# EAGLE design KramerMC_CPU_ferryTALE2022_v1.0 (EAGLE 6.6.0)

## Sheet 1 of 3: CPU+MEM
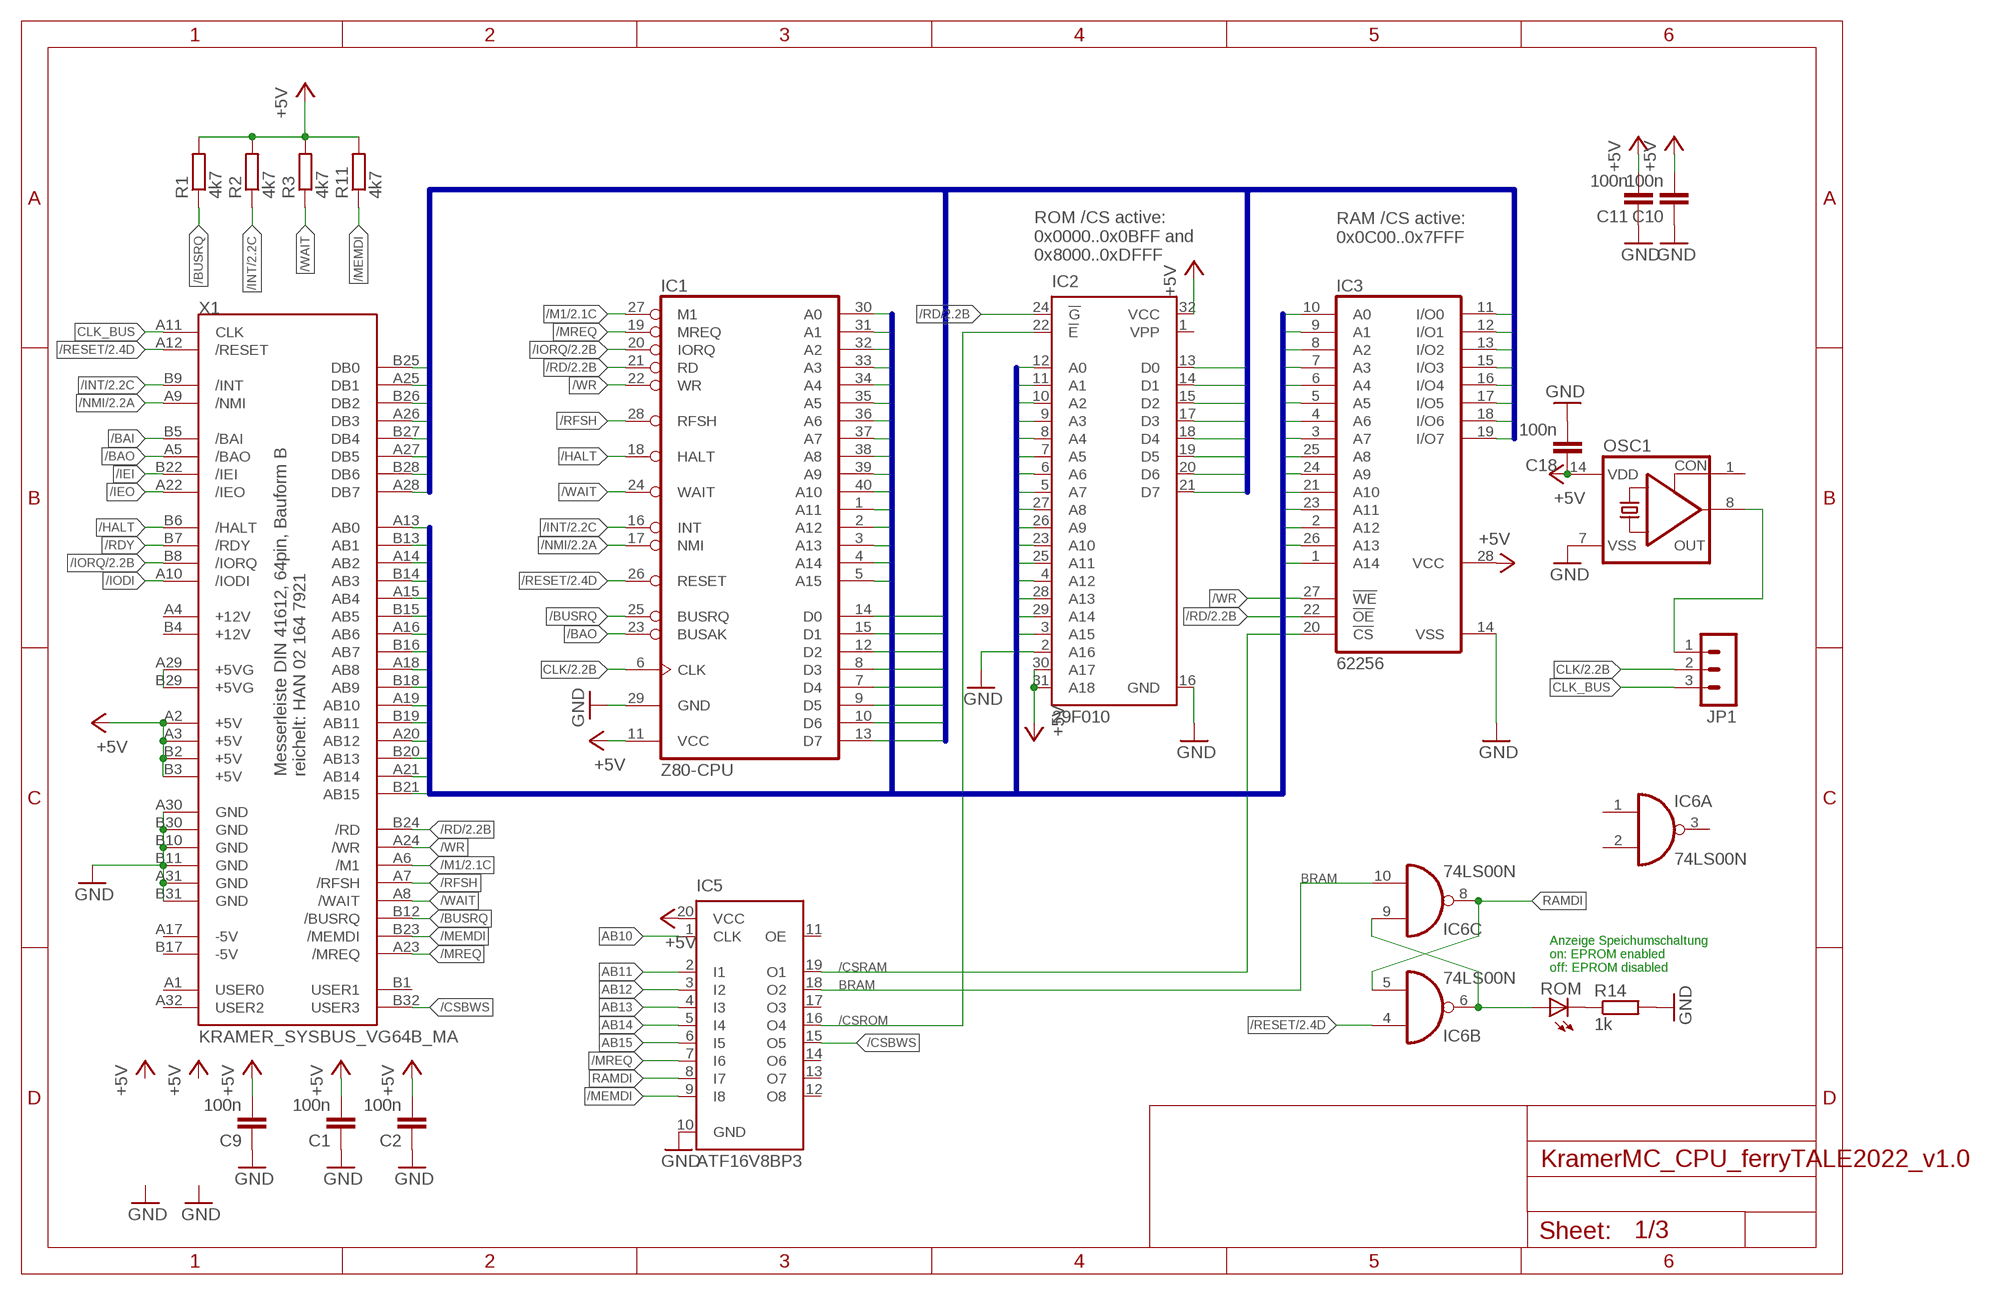
[diagram p0: schematic, sheet 1]

### Parts
C1  100n  C-EU050-024X044  [C050-024X044]
C2  100n  C-EU050-024X044  [C050-024X044]
C9  100n  C-EU050-024X044  [C050-024X044]
C10  100n  C-EU050-024X044  [C050-024X044]
C11  100n  C-EU050-024X044  [C050-024X044]
C18  100n  C-EU050-024X044  [C050-024X044]
IC1  Z80-CPU  Z80CPU  [DIL40]
IC2  29F010  M27C4001B  [DIL32]
IC3  62256  62256P  [DIL28-6]
IC5  ATF16V8BP3  [DIL20]
IC6  74LS00N  [DIL14]
JP1  MA03-1  [MA03-1]
OSC1  CRYSTAL_RES-SG51  [SG51]
R1  4k7  R-EU_0207/10  [0207/10]
R2  4k7  R-EU_0207/10  [0207/10]
R3  4k7  R-EU_0207/10  [0207/10]
R11  4k7  R-EU_0207/10  [0207/10]
R14  1k  R-EU_0207/10  [0207/10]
ROM  LED3MM  [LED3MM]
X1  KRAMER_SYSBUS_VG64B_MA  [MAB64]

### Nets
+5V: C1.2 C2.2 C9.2 C10.2 C11.2 C18.1 IC1.11(VCC) IC2.30(A17) IC2.31(A18) IC2.32(VCC) IC3.28(VCC) IC5.20(VCC) OSC1.14(VDD) R1.2 R2.2 R3.2 R11.2 X1.A2(+5V) X1.A3(+5V) X1.B2(+5V) X1.B3(+5V) ; also sheet 2,3
+5VG: X1.A29(+5VG) X1.B29(+5VG)
/BAI: X1.B5(/BAI)
/BAO: IC1.23(BUSAK) X1.A5(/BAO)
/BUSRQ: IC1.25(BUSRQ) R1.1 X1.B12(/BUSRQ)
/CSBWS: IC5.15(O5) X1.B32(USER3)
/CSRAM: IC3.20(!CS) IC5.19(O1)
/CSROM: IC2.22(!E) IC5.16(O4)
/HALT: IC1.18(HALT) X1.B6(/HALT)
/IEI: X1.B22(/IEI)
/IEO: X1.A22(/IEO)
/INT: IC1.16(INT) R2.1 X1.B9(/INT) ; also sheet 2
/IODI: X1.A10(/IODI)
/IORQ: IC1.20(IORQ) X1.B8(/IORQ) ; also sheet 2
/M1: IC1.27(M1) X1.A6(/M1) ; also sheet 2
/MEMDI: IC5.9(I8) R11.1 X1.B23(/MEMDI)
/MREQ: IC1.19(MREQ) IC5.7(I6) X1.A23(/MREQ)
/NMI: IC1.17(NMI) X1.A9(/NMI) ; also sheet 2
/RD: IC1.21(RD) IC2.24(!G) IC3.22(!OE) X1.B24(/RD) ; also sheet 2
/RDY: X1.B7(/RDY)
/RESET: IC1.26(RESET) IC6.4(B:I0) X1.A12(/RESET) ; also sheet 2
/RFSH: IC1.28(RFSH) X1.A7(/RFSH)
/WAIT: IC1.24(WAIT) R3.1 X1.A8(/WAIT)
/WR: IC1.22(WR) IC3.27(!WE) X1.A24(/WR)
AB0: IC1.30(A0) IC2.12(A0) IC3.10(A0) X1.A13(AB0) ; also sheet 2
AB1: IC1.31(A1) IC2.11(A1) IC3.9(A1) X1.B13(AB1) ; also sheet 2
AB2: IC1.32(A2) IC2.10(A2) IC3.8(A2) X1.A14(AB2)
AB3: IC1.33(A3) IC2.9(A3) IC3.7(A3) X1.B14(AB3)
AB4: IC1.34(A4) IC2.8(A4) IC3.6(A4) X1.A15(AB4)
AB5: IC1.35(A5) IC2.7(A5) IC3.5(A5) X1.B15(AB5)
AB6: IC1.36(A6) IC2.6(A6) IC3.4(A6) X1.A16(AB6) ; also sheet 2
AB7: IC1.37(A7) IC2.5(A7) IC3.3(A7) X1.B16(AB7) ; also sheet 2
AB8: IC1.38(A8) IC2.27(A8) IC3.25(A8) X1.A18(AB8)
AB9: IC1.39(A9) IC2.26(A9) IC3.24(A9) X1.B18(AB9)
AB10: IC1.40(A10) IC2.23(A10) IC3.21(A10) IC5.1(CLK) X1.A19(AB10)
AB11: IC1.1(A11) IC2.25(A11) IC3.23(A11) IC5.2(I1) X1.B19(AB11)
AB12: IC1.2(A12) IC2.4(A12) IC3.2(A12) IC5.3(I2) X1.A20(AB12)
AB13: IC1.3(A13) IC2.28(A13) IC3.26(A13) IC5.4(I3) X1.B20(AB13)
AB14: IC1.4(A14) IC2.29(A14) IC3.1(A14) IC5.5(I4) X1.A21(AB14)
AB15: IC1.5(A15) IC2.3(A15) IC5.6(I5) X1.B21(AB15)
BRAM: IC5.18(O2) IC6.10(C:I1)
CLK: IC1.6(CLK) JP1.2 ; also sheet 2
CLK_BUS: JP1.3 X1.A11(CLK)
DB0: IC1.14(D0) IC2.13(D0) IC3.11(I/O0) X1.B25(DB0) ; also sheet 2
DB1: IC1.15(D1) IC2.14(D1) IC3.12(I/O1) X1.A25(DB1) ; also sheet 2
DB2: IC1.12(D2) IC2.15(D2) IC3.13(I/O2) X1.B26(DB2) ; also sheet 2
DB3: IC1.8(D3) IC2.17(D3) IC3.15(I/O3) X1.A26(DB3) ; also sheet 2
DB4: IC1.7(D4) IC2.18(D4) IC3.16(I/O4) X1.B27(DB4) ; also sheet 2
DB5: IC1.9(D5) IC2.19(D5) IC3.17(I/O5) X1.A27(DB5) ; also sheet 2
DB6: IC1.10(D6) IC2.20(D6) IC3.18(I/O6) X1.B28(DB6) ; also sheet 2
DB7: IC1.13(D7) IC2.21(D7) IC3.19(I/O7) X1.A28(DB7) ; also sheet 2
GND: C1.1 C2.1 C9.1 C10.1 C11.1 C18.2 IC1.29(GND) IC2.2(A16) IC2.16(GND) IC3.14(VSS) IC5.10(GND) OSC1.7(VSS) R14.2 X1.A30(GND) X1.A31(GND) X1.B10(GND) X1.B11(GND) X1.B30(GND) X1.B31(GND) ; also sheet 2,3
N$1: IC6.6(B:O) IC6.9(C:I0) ROM.A
N$5: R14.1 ROM.K(C)
N$48: JP1.1 OSC1.8(OUT)
RAMDI: IC5.8(I7) IC6.5(B:I1) IC6.8(C:O)
Unconnected: IC5.11(OE) IC5.12(O8) IC5.13(O7) IC5.14(O6) IC5.17(O3) IC6.1(A:I0) IC6.2(A:I1) IC6.3(A:O) OSC1.1(CON) X1.A1(USER0) X1.A4(+12V) X1.A17(-5V) X1.A32(USER2) X1.B1(USER1) X1.B4(+12V) X1.B17(-5V)

### Buses
DB
AB

### Notes on the sheet
- RAM /CS active:
  0x0C00..0x7FFF
- ROM /CS active:
  0x0000..0x0BFF and
  0x8000..0xDFFF
- Messerleiste DIN 41612, 64pin, Bauform B
  reichelt: HAN 02 164 7921
- Anzeige Speichumschaltung
  on: EPROM enabled
  off: EPROM disabled

## Sheet 2 of 3: Keyb
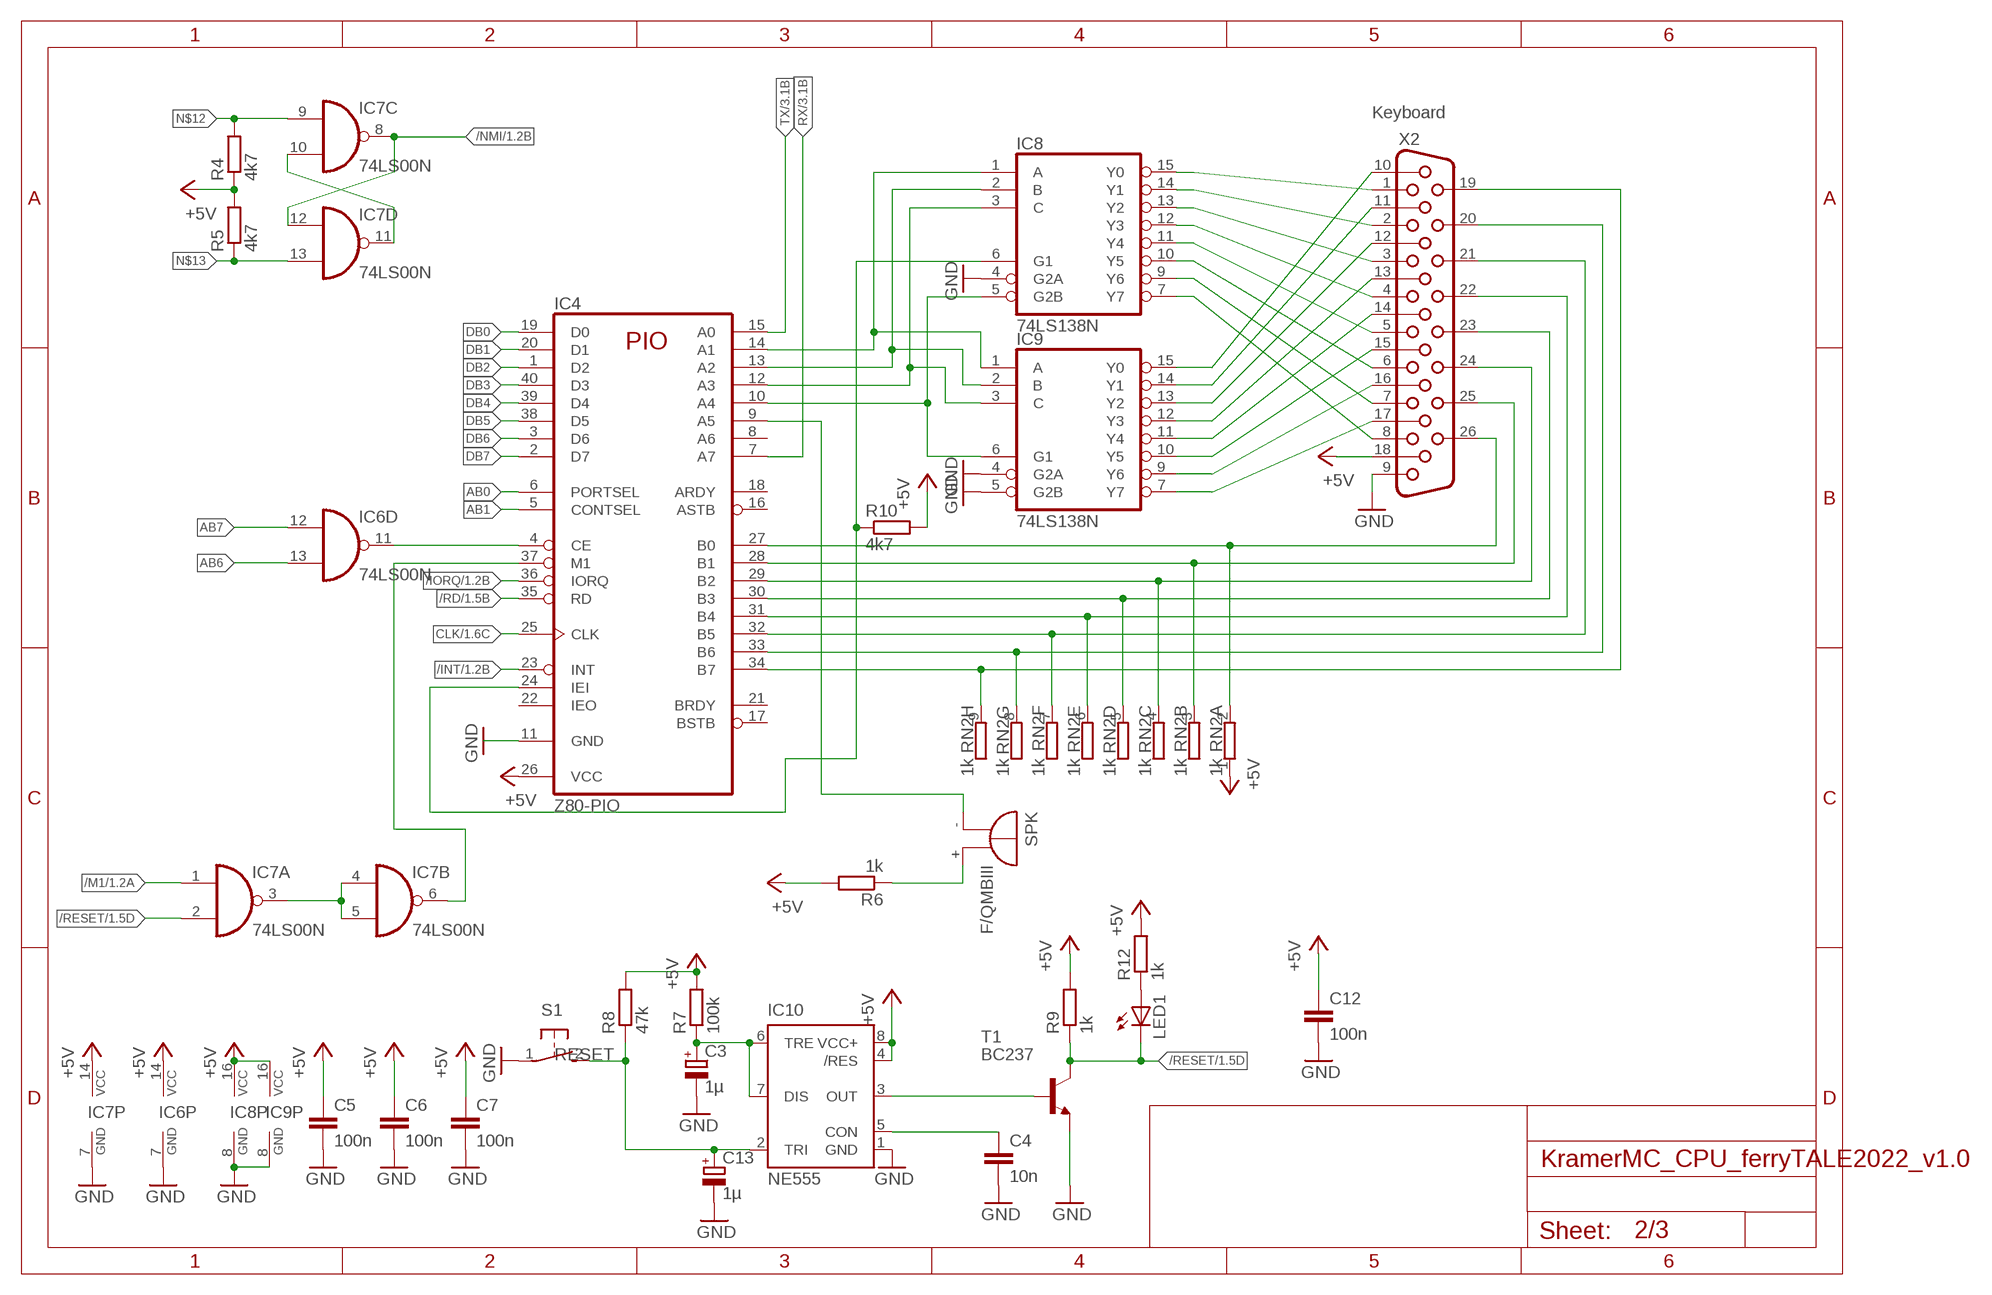
[diagram p1: schematic, sheet 2]

### Parts
C3  1µ  CPOL-EUE2-5  [E2-5]
C4  10n  C-EU050-024X044  [C050-024X044]
C5  100n  C-EU050-024X044  [C050-024X044]
C6  100n  C-EU050-024X044  [C050-024X044]
C7  100n  C-EU050-024X044  [C050-024X044]
C12  100n  C-EU050-024X044  [C050-024X044]
C13  1µ  CPOL-EUE2-5  [E2-5]
IC4  Z80-PIO  Z80PIO  [DIL40]
IC7  74LS00N  [DIL14]
IC8  74LS138N  [DIL16]
IC9  74LS138N  [DIL16]
IC10  NE555  [DIL-08]
LED1  LED3MM  [LED3MM]
R4  4k7  R-EU_0207/10  [0207/10]
R5  4k7  R-EU_0207/10  [0207/10]
R6  1k  R-EU_0207/10  [0207/10]
R7  100k  R-EU_0207/2V  [0207/2V]
R8  47k  R-EU_0207/10  [0207/10]
R9  1k  R-EU_0207/2V  [0207/2V]
R10  4k7  R-EU_0207/10  [0207/10]
R12  1k  R-EU_0207/2V  [0207/2V]
RN2  1k  GE08R  [SIL9]
S1  31-XX  [B3F-31XX]
SPK  F/QMBIII  [F/QMBIII]
T1  BC237  [TO92]
X2  HF26H  [HDF26H]

### Nets
+5V: C5.1 C6.1 C7.1 C12.1 IC4.26(VCC) IC6.14(P:VCC) IC7.14(P:VCC) IC8.16(VCC) IC9.16(VCC) IC10.4(/RES) IC10.8(VCC+) R4.1 R5.2 R6.2 R7.2 R8.2 R9.2 R10.2 R12.2 RN2.1 X2.18 ; also sheet 1,3
/INT: IC4.23(INT) ; also sheet 1
/IORQ: IC4.36(IORQ) ; also sheet 1
/M1: IC7.1(A:I0) ; also sheet 1
/NMI: IC7.8(C:O) IC7.12(D:I0) ; also sheet 1
/RD: IC4.35(RD) ; also sheet 1
/RESET: IC7.2(A:I1) LED1.K(C) R9.1 T1.3(C) ; also sheet 1
AB0: IC4.6(PORTSEL) ; also sheet 1
AB1: IC4.5(CONTSEL) ; also sheet 1
AB6: IC6.13(D:I1) ; also sheet 1
AB7: IC6.12(D:I0) ; also sheet 1
CLK: IC4.25(CLK) ; also sheet 1
DB0: IC4.19(D0) ; also sheet 1
DB1: IC4.20(D1) ; also sheet 1
DB2: IC4.1(D2) ; also sheet 1
DB3: IC4.40(D3) ; also sheet 1
DB4: IC4.39(D4) ; also sheet 1
DB5: IC4.38(D5) ; also sheet 1
DB6: IC4.3(D6) ; also sheet 1
DB7: IC4.2(D7) ; also sheet 1
GND: C3.- C4.2 C5.2 C6.2 C7.2 C12.2 C13.- IC4.11(GND) IC6.7(P:GND) IC7.7(P:GND) IC8.4(G2A) IC8.8(GND) IC9.4(G2A) IC9.5(G2B) IC9.8(GND) IC10.1(GND) S1.1(P) T1.1(E) X2.9 ; also sheet 1,3
N$9: LED1.A R12.1
N$10: IC8.15(Y0) X2.1
N$11: IC7.10(C:I1) IC7.11(D:O)
N$12: IC7.9(C:I0) R4.2
N$13: IC7.13(D:I1) R5.1
N$14: IC4.14(A1) IC8.1(A) IC9.1(A)
N$15: IC4.13(A2) IC8.2(B) IC9.2(B)
N$16: IC4.12(A3) IC8.3(C) IC9.3(C)
N$17: IC7.3(A:O) IC7.4(B:I0) IC7.5(B:I1)
N$18: IC8.14(Y1) X2.2
N$19: IC4.4(CE) IC6.11(D:O)
N$20: IC4.37(M1) IC7.6(B:O)
N$21: IC8.13(Y2) X2.3
N$22: IC8.12(Y3) X2.4
N$23: IC8.11(Y4) X2.5
N$24: IC8.10(Y5) X2.6
N$25: IC8.9(Y6) X2.7
N$26: IC8.7(Y7) X2.8
N$27: IC4.27(B0) RN2.2 X2.26
N$28: IC4.28(B1) RN2.3 X2.25
N$29: IC4.29(B2) RN2.4 X2.24
N$30: IC4.30(B3) RN2.5 X2.23
N$31: IC4.31(B4) RN2.6 X2.22
N$32: IC4.32(B5) RN2.7 X2.21
N$33: IC4.33(B6) RN2.8 X2.20
N$34: IC4.34(B7) RN2.9 X2.19
N$35: IC4.9(A5) SPK.-(+)
N$36: IC10.3(OUT) T1.2(B)
N$37: C3.+ IC10.6(TRE) IC10.7(DIS) R7.1
N$38: C4.1 IC10.5(CON)
N$39: R6.1 SPK.+(-)
N$40: IC4.24(IEI) IC8.6(G1) R10.1
N$276: IC4.10(A4) IC8.5(G2B) IC9.6(G1)
N$283: IC9.15(Y0) X2.10
N$284: IC9.14(Y1) X2.11
N$285: IC9.13(Y2) X2.12
N$286: IC9.12(Y3) X2.13
N$287: IC9.11(Y4) X2.14
N$288: IC9.10(Y5) X2.15
N$301: IC9.9(Y6) X2.16
N$302: IC9.7(Y7) X2.17
RESET_BUTTON: C13.+ IC10.2(TRI) R8.1 S1.2(S)
RX: IC4.7(A7) ; also sheet 3
TX: IC4.15(A0) ; also sheet 3
Unconnected: IC4.8(A6) IC4.16(ASTB) IC4.17(BSTB) IC4.18(ARDY) IC4.21(BRDY) IC4.22(IEO)

### Notes on the sheet
- Keyboard
- RESET

## Sheet 3 of 3: CASS
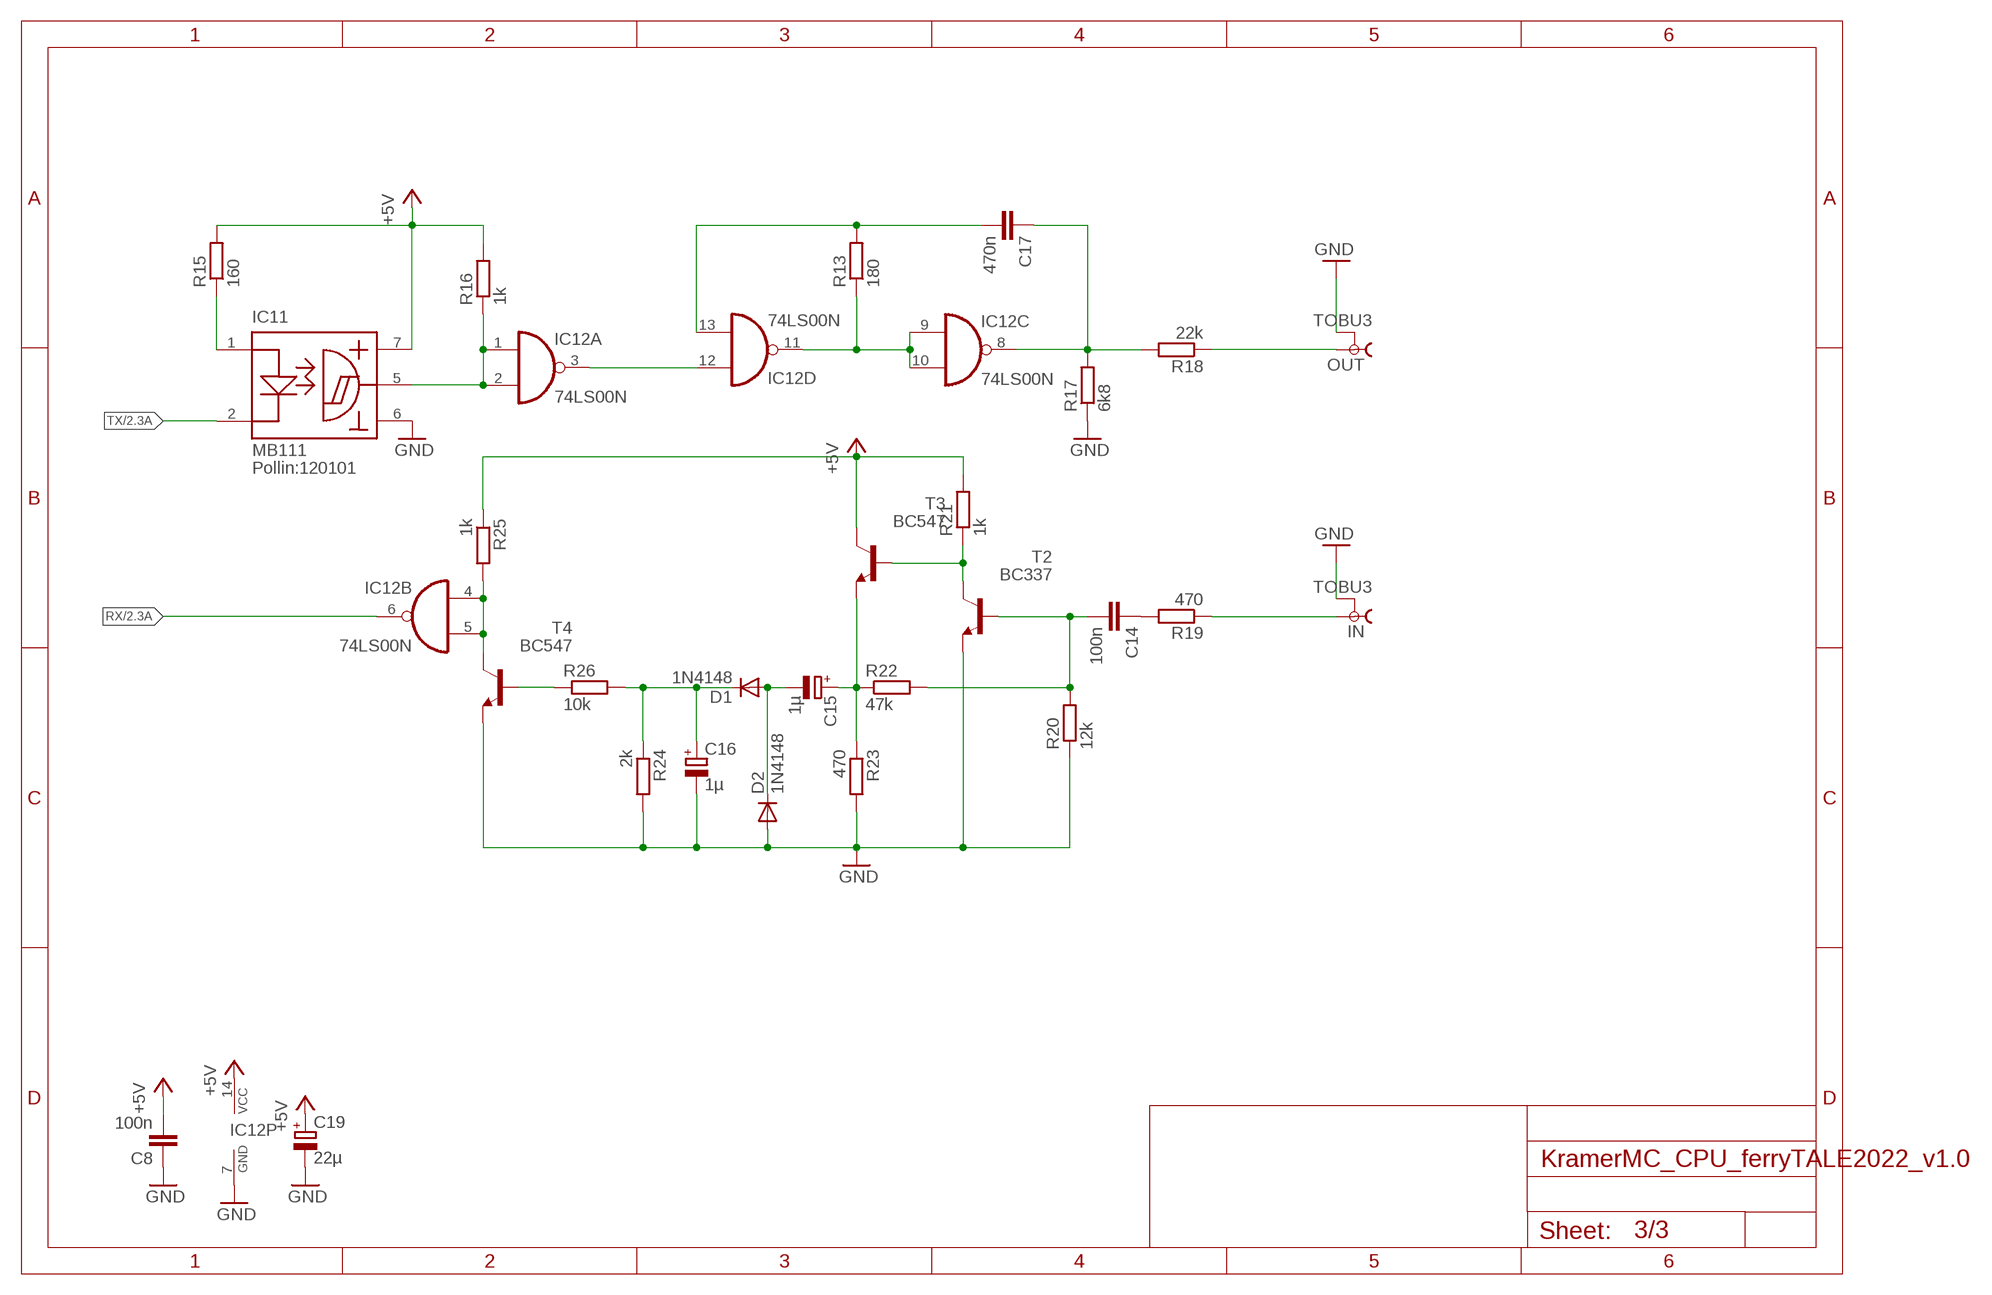
[diagram p2: schematic, sheet 3]

### Parts
C8  100n  C-EU050-024X044  [C050-024X044]
C14  100n  C-EU050-024X044  [C050-024X044]
C15  1µ  CPOL-EUE2-4  [E2-4]
C16  1µ  CPOL-EUE2-4  [E2-4]
C17  470n  C-EU050-024X044  [C050-024X044]
C19  22µ  CPOL-EUE2-4  [E2-4]
D1  1N4148  1N4148DO35-7  [DO35-7]
D2  1N4148  1N4148DO35-7  [DO35-7]
IC11  MB111  [DIL08]
IC12  74LS00N  [DIL14]
IN  TOBU3  [TOBU3]
OUT  TOBU3  [TOBU3]
R13  180  R-EU_0207/10  [0207/10]
R15  160  R-EU_0207/10  [0207/10]
R16  1k  R-EU_0207/2V  [0207/2V]
R17  6k8  R-EU_0207/10  [0207/10]
R18  22k  R-EU_0207/10  [0207/10]
R19  470  R-EU_0207/10  [0207/10]
R20  12k  R-EU_0207/10  [0207/10]
R21  1k  R-EU_0207/10  [0207/10]
R22  47k  R-EU_0207/2V  [0207/2V]
R23  470  R-EU_0207/10  [0207/10]
R24  2k  R-EU_0207/10  [0207/10]
R25  1k  R-EU_0207/2V  [0207/2V]
R26  10k  R-EU_0207/10  [0207/10]
T2  BC337  [TO92]
T3  BC547  [TO92]
T4  BC547  [TO92]

### Nets
+5V: C8.2 C19.+ IC11.7(VCC) IC12.14(P:VCC) R15.2 R16.2 R21.2 R25.1 T3.3(C) ; also sheet 1,2
GND: C8.1 C16.- C19.- D2.A IC11.6(GND) IC12.7(P:GND) IN.2 IN.2@1 IN.2@2 OUT.2 OUT.2@1 OUT.2@2 R17.1 R20.1 R23.2 R24.2 T2.1(E) T4.1(E) ; also sheet 1,2
N$2: IC11.1(A) R15.1
N$3: IC12.3(A:O) IC12.12(D:I0)
N$4: IC11.5(OUT) IC12.1(A:I0) IC12.2(A:I1) R16.1
N$6: C17.2 IC12.13(D:I1) R13.2
N$7: IC12.9(C:I0) IC12.10(C:I1) IC12.11(D:O) R13.1
N$8: OUT.1 R18.1
N$41: IC12.4(B:I0) IC12.5(B:I1) R25.2 T4.3(C)
N$42: C14.1 R19.2
N$43: C17.1 IC12.8(C:O) R17.2 R18.2
N$44: R21.1 T2.3(C) T3.2(B)
N$45: C14.2 R20.2 R22.2 T2.2(B)
N$46: IN.1 R19.1
N$50: R26.1 T4.2(B)
N$51: C16.+ D1.C R24.1 R26.2
N$52: C15.- D1.A D2.C
N$53: C15.+ R22.1 R23.1 T3.1(E)
RX: IC12.6(B:O) ; also sheet 2
TX: IC11.2(K) ; also sheet 2

### Notes on the sheet
- Pollin:120101

## Power pins joined to a net without a drawn wire
VPP: IC2.1(VPP)

## Library data of the parts
C1 C2 C4-C12 C14 C17 C18 = rcl:C-EU: CAPACITOR, European symbol
C3 C13 C15 C16 C19 = rcl:CPOL-EU: POLARIZED CAPACITOR, European symbol
D1 D2 = diode:1N4148: DIODE high speed (Philips)
IC1 = zilog:Z80CPU: Z80 FAMILY DEVICE
IC2 = st-microelectronics:M27C4001: 4 Mbit (512Kb x 8) UV EPROM and OTP EPROM Source: www.st.com .. M27C4001 EPROM 4 MBIT.pdf; MPN: M27C4001-10B1; OC_FARNELL: 3338137; OC_NEWARK: 56P9200
IC3 = memory-hitachi:62256P: MEMORY; OC_FARNELL: unknown; OC_NEWARK: unknown
IC4 = zilog:Z80PIO: Z80 FAMILY DEVICE
IC5 = atmel:ATF16V8B: High perfomance CMOS (electrically erasable) programmable logic device (PLD) ABLE-Atmel-ABEL - P18V8R, P16V8C, P16V8AS, P17V8 COPL Atmel-WinCUPL - G16V8MS, G16V8MA, G16V8AS, G16V8 LOG/IC - GAL16V8_R, GAL16V8_G7, GAL16V8_C), GAL16V8 Tango-PLD - G16V8R, G16V8C, G16V8AS, G16V8 Source: http://www.atmel.com/dyn/resources/prod_documents/DOC0364.PDF; MPN: ATF16V8CZ-15PU; OC_FARNELL: 1551768; OC_NEWARK: 94M6254
IC6 IC7 IC12 = 74xx-eu:74*00: Quad 2-input NAND gate
IC8 IC9 = 74xx-eu:74*138: 3-line to 8-line DECODER/DEMULTIPLEXER
IC10 = st-microelectronics:NE555: General purpose bipolar Timer; MF: Arrow Electronics; MPN: NE555N; OC_FARNELL: 1467742; OC_NEWARK: 89K1486
IC11 = ferry_Kramer_KC:MB111: MB111 Optocoupler with TTL driver (Schmitt-Trigger) replace type = MCL611
IN OUT = ferry_con:TOBU3: Female Cinch CONNECTOR ( RCA Jack ); MF: FARNELL; MPN: TOBU 3; OC_FARNELL: 592791; OC_NEWARK: 06WX5914
JP1 = con-lstb:MA03-1: PIN HEADER; OC_FARNELL: unknown; OC_NEWARK: unknown
LED1 ROM = led:LED: LED OSRAM: - CHIPLED LG R971, LG N971, LY N971, LG Q971, LY Q971, LO R971, LY R971 LH N974, LH R974 LS Q976, LO Q976, LY Q976 LO Q996 - Hyper CHIPLED LW Q18S LB Q993, LB Q99A, LB R99A - SideLED LS A670, LO A670, LY A670, LG A670, LP A670 LB A673, LV A673, LT A673, LW A673 LH A674 LY A675 LS A676, LA A676, LO A676, LY A676, LW A676 LS A679, LY A679, LG A679 - Hyper Micro SIDELED® LS Y876, LA Y876, LO Y876, LY Y876 LT Y87S - SmartLED LW L88C, LW L88S LB L89C, LB L89S, LG L890 LS L89K, LO L89K, LY L89K LS L896, LA L896, LO L896, LY L896 - TOPLED LS T670, LO T670, LY T670, LG T670, LP T670 LSG T670, LSP T670, LSY T670, LOP T670, LYG T670 LG T671, LOG T671, LSG T671 LB T673, LV T673, LT T673, LW T673 LH T674 LS T676, LA T676, LO T676, LY T676, LB T676, LH T676, LSB T676, LW T676 LB T67C, LV T67C, LT T67C, LS T67K, LO T67K, LY T67K, LW E67C LS E67B, LA E67B, LO E67B, LY E67B, LB E67C, LV E67C, LT E67C LW T67C LS T679, LY T679, LG T679 LS T770, LO T770, LY T770, LG T770, LP T770 LB T773, LV T773, LT T773, LW T773 LH T774 LS E675, LA E675, LY E675, LS T675 LS T776, LA T776, LO T776, LY T776, LB T776 LHGB T686 LT T68C, LB T68C - Hyper Mini TOPLED® LB M676 - Mini TOPLED Santana® LG M470 LS M47K, LO M47K, LY M47K Source: http://www.osram.convergy.de LUXEON: - LUMILED® LXK2-PW12-R00, LXK2-PW12-S00, LXK2-PW14-U00, LXK2-PW14-V00 LXK2-PM12-R00, LXK2-PM12-S00, LXK2-PM14-U00 LXK2-PE12-Q00, LXK2-PE12-R00, LXK2-PE12-S00, LXK2-PE14-T00, LXK2-PE14-U00 LXK2-PB12-K00, LXK2-PB12-L00, LXK2-PB12-M00, LXK2-PB14-N00, LXK2-PB14-P00, LXK2-PB14-Q00 LXK2-PR12-L00, LXK2-PR12-M00, LXK2-PR14-Q00, LXK2-PR14-R00 LXK2-PD12-Q00, LXK2-PD12-R00, LXK2-PD12-S00 LXK2-PH12-R00, LXK2-PH12-S00 LXK2-PL12-P00, LXK2-PL12-Q00, LXK2-PL12-R00 Source: www.luxeon.com KINGBRIGHT: KA-3528ASYC Source: www.kingbright.com
OSC1 = crystal:CRYSTAL_RES-: CRYSTAL RESONATOR; OC_FARNELL: unknown; OC_NEWARK: unknown
R1-R26 = rcl:R-EU_: RESISTOR, European symbol
RN2 = resistor-sil:GE08R: SIL RESISTOR; OC_FARNELL: unknown; OC_NEWARK: unknown
S1 = switch-omron:31-XX: OMRON SWITCH; MPN: B3F-3100; OC_FARNELL: 959704; OC_NEWARK: 36M3582
SPK = buzzer:F/QMBIII: BUZZER Source: Buerklin; OC_FARNELL: unknown; OC_NEWARK: unknown
T1 = transistor:BC237: NPN TRANSISTOR
T2 = transistor:BC337: NPN TRANSISTOR
T3 T4 = transistor:BC547: NPN TRANSISTOR
X1 = ferry_Kramer_KC:KRAMER_SYSBUS: Kramer Kleincomputer System-Bus Buchse _MA für Module _FE für Busplatine
X2 = con-subd:HF26: SUB-D; OC_FARNELL: unknown; OC_NEWARK: unknown

## Board
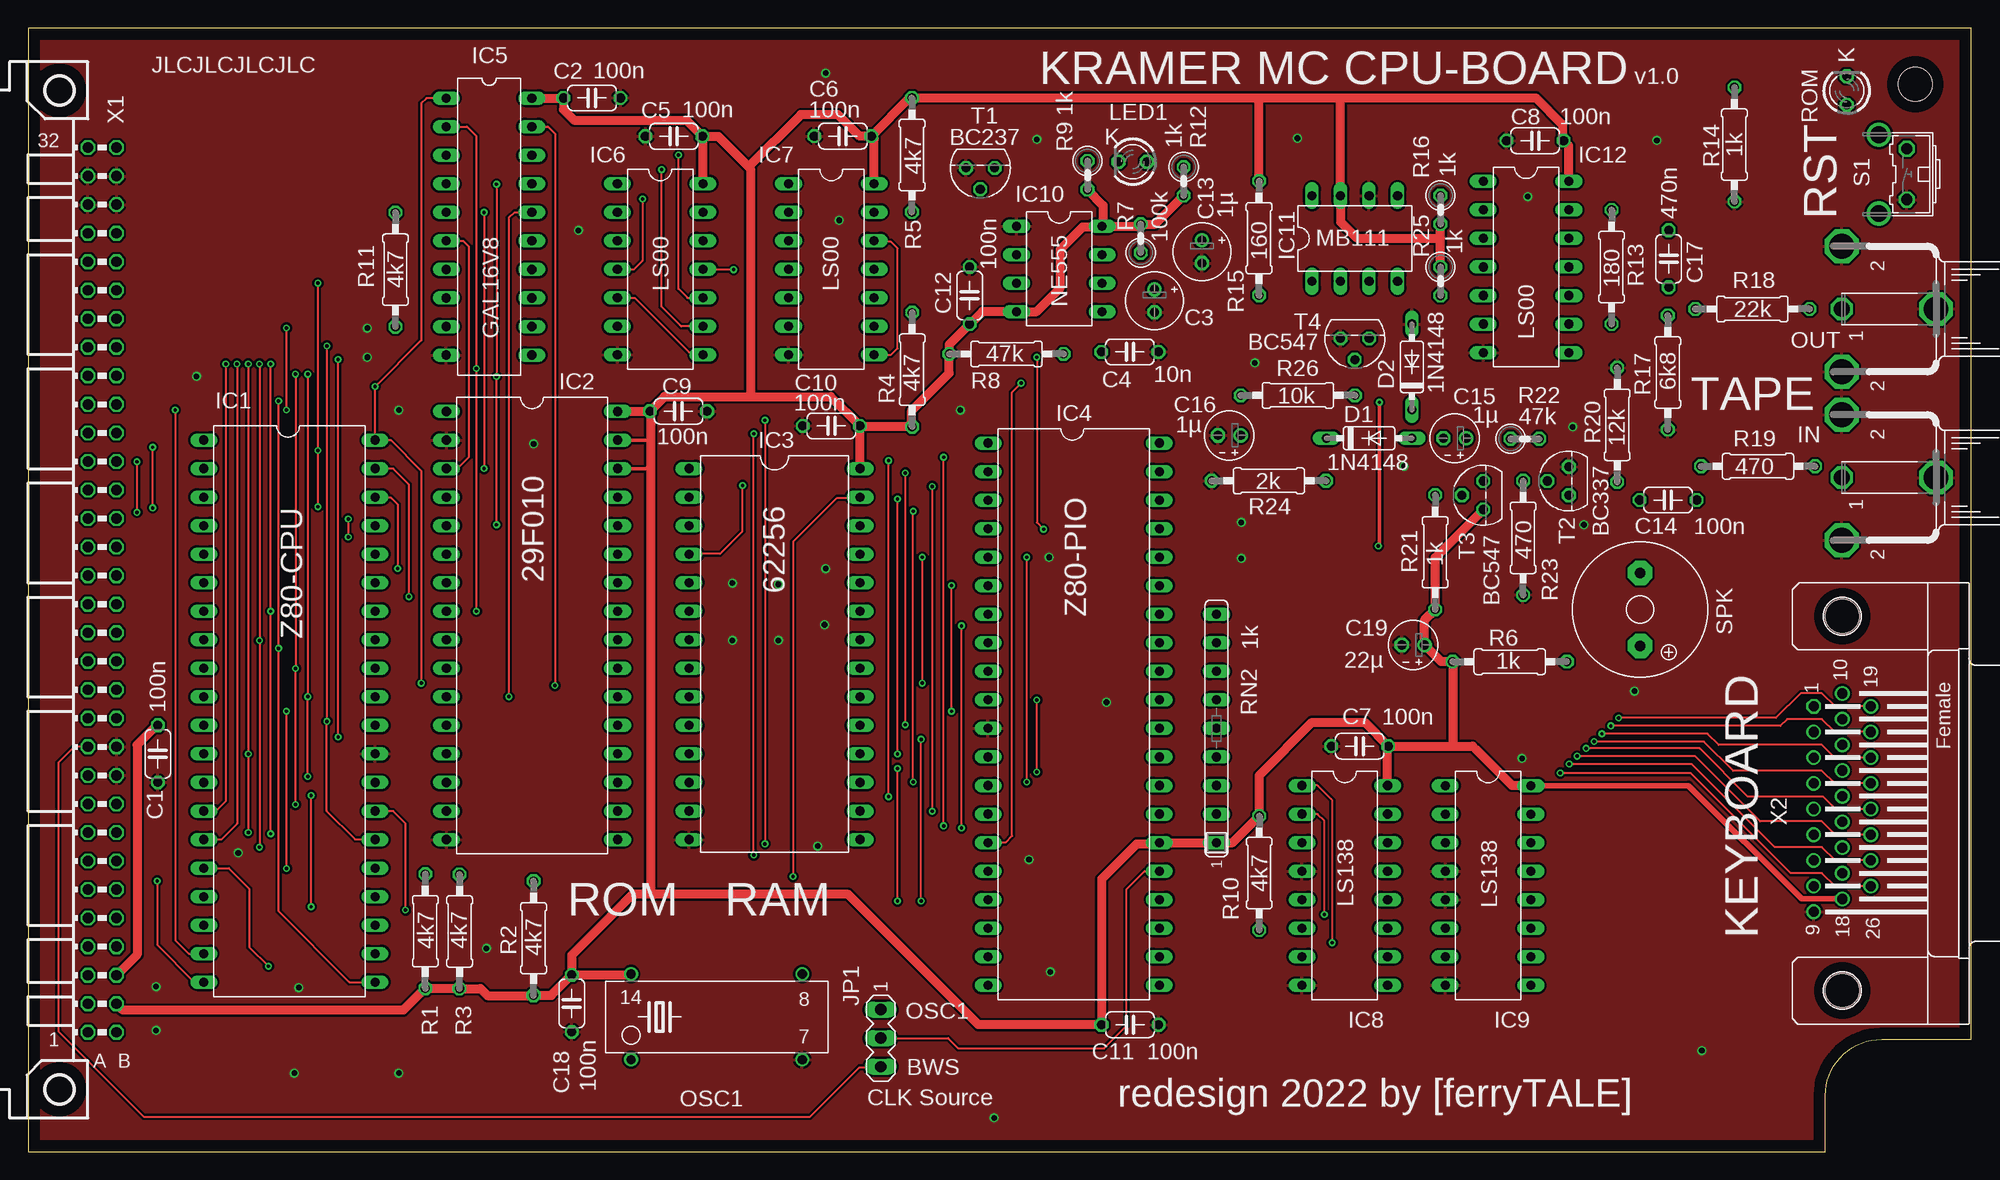
[diagram p3: board, top side]
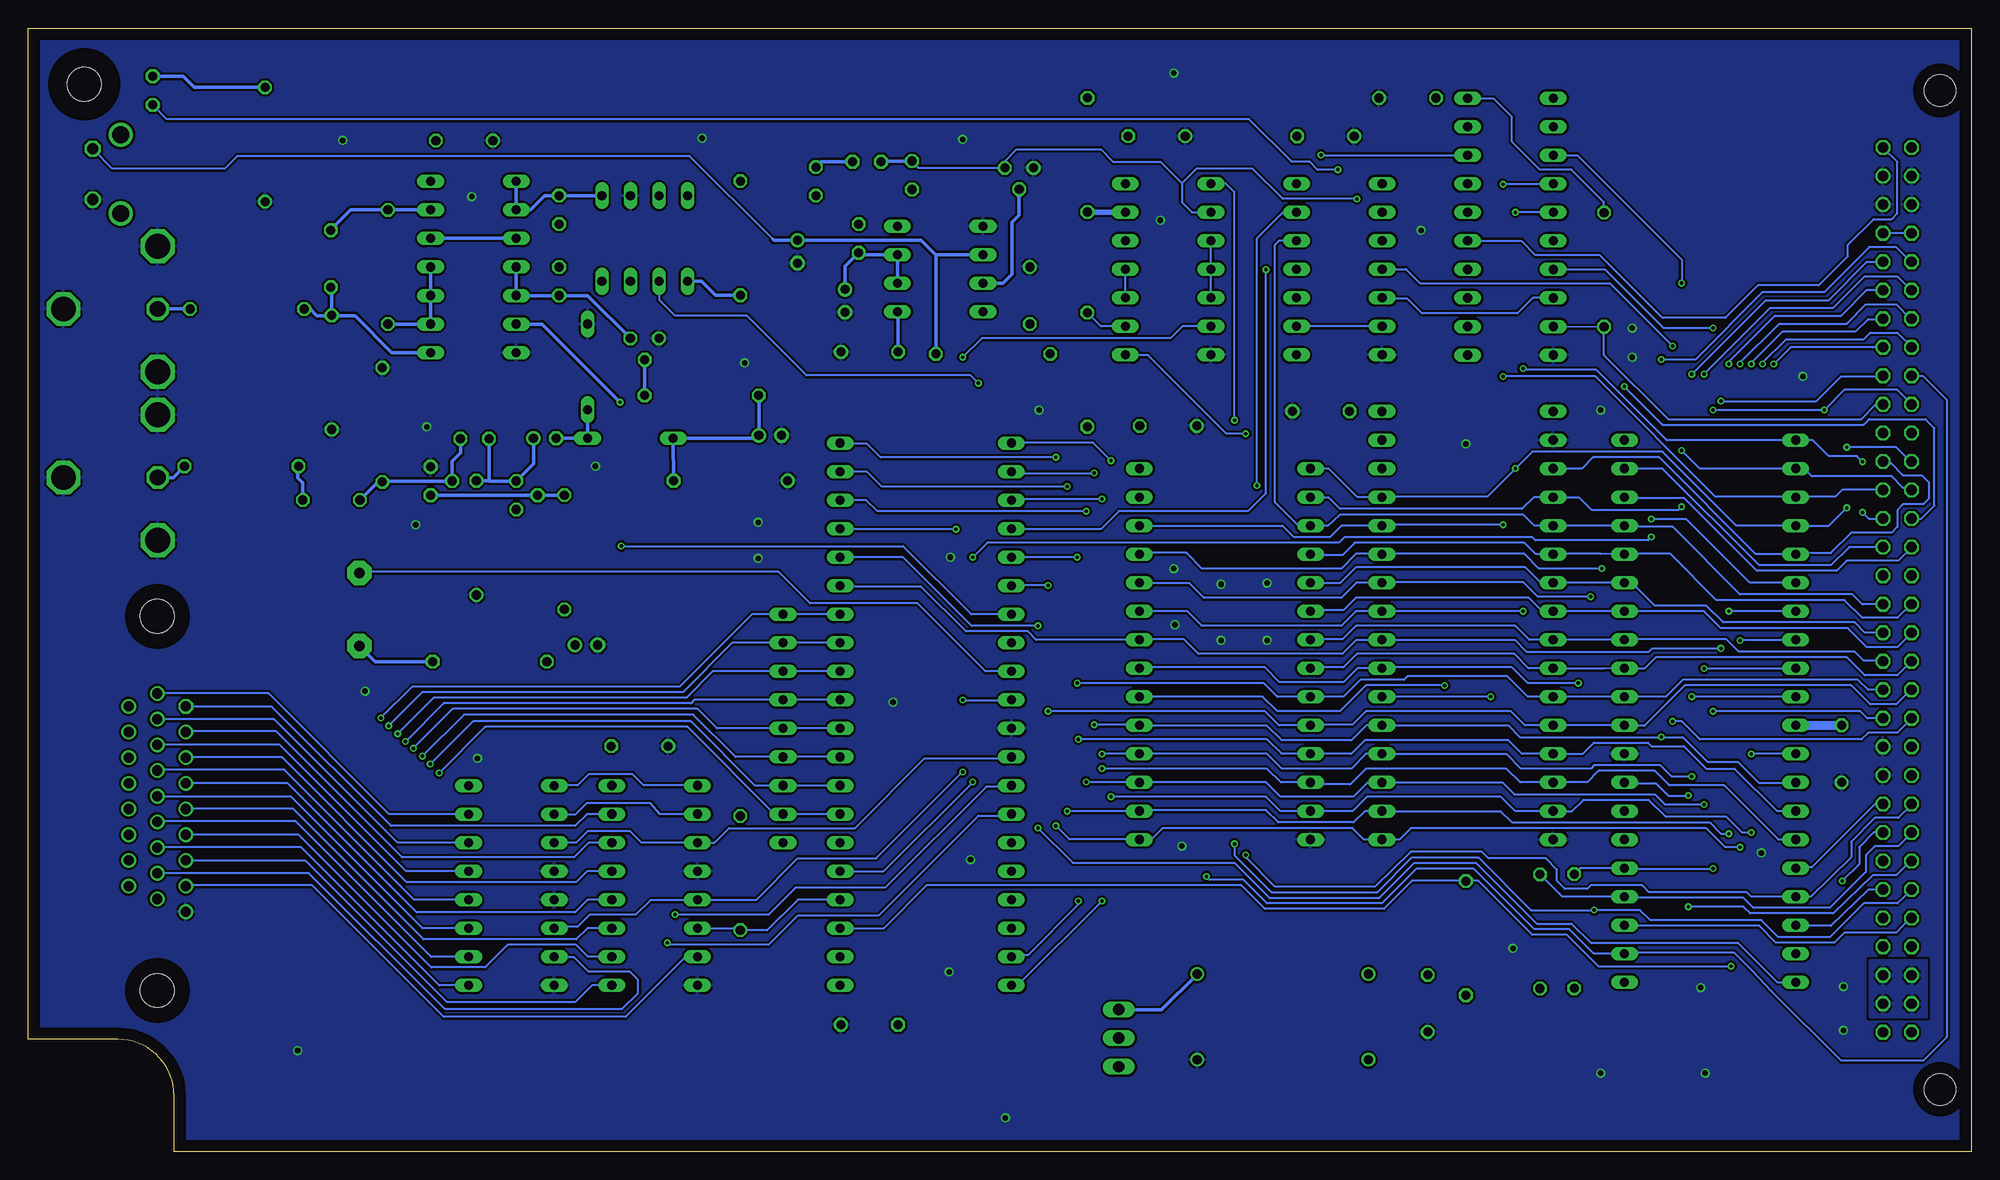
[diagram p4: board, bottom side, seen from below]

Size 173 x 100 mm. Coordinates in mm from the lower left corner, seen from the top.
Outline: 0,0 160,0 160,5 arc-90 165,10 173,10 173,100 0,100 0,0
Copper layers (1+16): Top 0.035mm / dielectric 0.38mm / Bottom 0.035mm
Design rules "PCB-POOL Standard_ML4 *": minimum track width 0.15mm, minimum drill 0.3mm, track to track 0.15mm, track to pad 0.15mm, pad to pad 0.15mm, via to via 0.15mm, smd to smd 0.15mm, copper to edge 1mm, drill to drill 0.2mm, minimum pad ring 0.2mm, minimum via ring 0.15mm, stop-mask expansion 0.075mm, vias tented up to drill 0mil, thermal gap 0.2mm
Holes 3 mm at 168,95
bRestrict: area 165,92 to 171,98

### Footprints (pad centres in the part's own frame; a part is rotated, then mirrored left to right if it is on the bottom)
C050-024X044 = drill 0.813 octagon: 1 -2.54,0; 2 2.54,0
E2-5 = drill 0.813 pad 1.27: + -1.016,0 | drill 0.813 pad 1.27 octagon: - 1.016,0
E2-4 = drill 0.813 pad 1.27: + -1.016,0 | drill 0.813 pad 1.27 octagon: - 1.016,0
DO35-7 = drill 0.813 long: A 3.81,0; C -3.81,0
DIL40 = drill 0.813 long: 1 -24.13,-7.62; 2 -21.59,-7.62; 3 -19.05,-7.62; 4 -16.51,-7.62; 5 -13.97,-7.62; 6 -11.43,-7.62; 7 -8.89,-7.62; 8 -6.35,-7.62; 9 -3.81,-7.62; 10 -1.27,-7.62; 11 1.27,-7.62; 12 3.81,-7.62; 13 6.35,-7.62; 14 8.89,-7.62; 15 11.43,-7.62; 16 13.97,-7.62; 17 16.51,-7.62; 18 19.05,-7.62; 19 21.59,-7.62; 20 24.13,-7.62; 21 24.13,7.62; 22 21.59,7.62; 23 19.05,7.62; 24 16.51,7.62; 25 13.97,7.62; 26 11.43,7.62; 27 8.89,7.62; 28 6.35,7.62; 29 3.81,7.62; 30 1.27,7.62; 31 -1.27,7.62; 32 -3.81,7.62; 33 -6.35,7.62; 34 -8.89,7.62; 35 -11.43,7.62; 36 -13.97,7.62; 37 -16.51,7.62; 38 -19.05,7.62; 39 -21.59,7.62; 40 -24.13,7.62
DIL32 = drill 0.813 long: 1 -19.05,-7.62; 2 -16.51,-7.62; 3 -13.97,-7.62; 4 -11.43,-7.62; 5 -8.89,-7.62; 6 -6.35,-7.62; 7 -3.81,-7.62; 8 -1.27,-7.62; 9 1.27,-7.62; 10 3.81,-7.62; 11 6.35,-7.62; 12 8.89,-7.62; 13 11.43,-7.62; 14 13.97,-7.62; 15 16.51,-7.62; 16 19.05,-7.62; 17 19.05,7.62; 18 16.51,7.62; 19 13.97,7.62; 20 11.43,7.62; 21 8.89,7.62; 22 6.35,7.62; 23 3.81,7.62; 24 1.27,7.62; 25 -1.27,7.62; 26 -3.81,7.62; 27 -6.35,7.62; 28 -8.89,7.62; 29 -11.43,7.62; 30 -13.97,7.62; 31 -16.51,7.62; 32 -19.05,7.62
DIL28-6 = drill 0.813 long: 1 -16.51,-7.62; 2 -13.97,-7.62; 3 -11.43,-7.62; 4 -8.89,-7.62; 5 -6.35,-7.62; 6 -3.81,-7.62; 7 -1.27,-7.62; 8 1.27,-7.62; 9 3.81,-7.62; 10 6.35,-7.62; 11 8.89,-7.62; 12 11.43,-7.62; 13 13.97,-7.62; 14 16.51,-7.62; 15 16.51,7.62; 16 13.97,7.62; 17 11.43,7.62; 18 8.89,7.62; 19 6.35,7.62; 20 3.81,7.62; 21 1.27,7.62; 22 -1.27,7.62; 23 -3.81,7.62; 24 -6.35,7.62; 25 -8.89,7.62; 26 -11.43,7.62; 27 -13.97,7.62; 28 -16.51,7.62
DIL20 = drill 0.813 long: 1 -11.43,-3.81; 2 -8.89,-3.81; 3 -6.35,-3.81; 4 -3.81,-3.81; 5 -1.27,-3.81; 6 1.27,-3.81; 7 3.81,-3.81; 8 6.35,-3.81; 9 8.89,-3.81; 10 11.43,-3.81; 11 11.43,3.81; 12 8.89,3.81; 13 6.35,3.81; 14 3.81,3.81; 15 1.27,3.81; 16 -1.27,3.81; 17 -3.81,3.81; 18 -6.35,3.81; 19 -8.89,3.81; 20 -11.43,3.81
DIL14 = drill 0.813 long: 1 -7.62,-3.81; 2 -5.08,-3.81; 3 -2.54,-3.81; 4 0,-3.81; 5 2.54,-3.81; 6 5.08,-3.81; 7 7.62,-3.81; 8 7.62,3.81; 9 5.08,3.81; 10 2.54,3.81; 11 0,3.81; 12 -2.54,3.81; 13 -5.08,3.81; 14 -7.62,3.81
DIL16 = drill 0.813 long: 1 -8.89,-3.81; 2 -6.35,-3.81; 3 -3.81,-3.81; 4 -1.27,-3.81; 5 1.27,-3.81; 6 3.81,-3.81; 7 6.35,-3.81; 8 8.89,-3.81; 9 8.89,3.81; 10 6.35,3.81; 11 3.81,3.81; 12 1.27,3.81; 13 -1.27,3.81; 14 -3.81,3.81; 15 -6.35,3.81; 16 -8.89,3.81
DIL-08 = drill 0.813 long: 1 -3.81,-3.81; 2 -1.27,-3.81; 3 1.27,-3.81; 4 3.81,-3.81; 5 3.81,3.81; 6 1.27,3.81; 7 -1.27,3.81; 8 -3.81,3.81
DIL08 = drill 0.813 long: 1 -3.81,-3.81; 2 -1.27,-3.81; 3 1.27,-3.81; 4 3.81,-3.81; 5 3.81,3.81; 6 1.27,3.81; 7 -1.27,3.81; 8 -3.81,3.81
TOBU3 = drill 1.397 pad 2 octagon: 1 0,-2.54 | drill 2.21 pad 3 octagon: 2 5.588,-2.54; 2@1 -5.588,-2.54; 2@2 0,5.85
MA03-1 = drill 1.016 long: 1 -2.54,0; 2 0,0; 3 2.54,0
LED3MM = drill 0.813 octagon: A -1.27,0; K 1.27,0
SG51 = drill 0.813: 1 -7.62,-3.81; 7 7.62,-3.81; 8 7.62,3.81; 14 -7.62,3.81
0207/10 = drill 0.813 octagon: 1 -5.08,0; 2 5.08,0
0207/2V = drill 0.813 octagon: 1 -1.27,0; 2 1.27,0
SIL9 = drill 0.813 long: 1 -10.16,0; 2 -7.62,0; 3 -5.08,0; 4 -2.54,0; 5 0,0; 6 2.54,0; 7 5.08,0; 8 7.62,0; 9 10.16,0
B3F-31XX = drill 1.016 octagon: 1 -2.261,-1.245; 2 2.261,-1.245 | drill 1.499 pad 2.159: 3 -3.505,1.245; 4 3.505,1.245
F/QMBIII = drill 0.914 pad 2.159 octagon: + 3.251,0; - -3.251,0
TO92 = drill 0.813 octagon: 1 1.27,0; 2 0,1.905; 3 -1.27,0
MAB64 = drill 0.914 octagon: A1 39.37,-1.27; A2 36.83,-1.27; A3 34.29,-1.27; A4 31.75,-1.27; A5 29.21,-1.27; A6 26.67,-1.27; A7 24.13,-1.27; A8 21.59,-1.27; A9 19.05,-1.27; A10 16.51,-1.27; A11 13.97,-1.27; A12 11.43,-1.27; A13 8.89,-1.27; A14 6.35,-1.27; A15 3.81,-1.27; A16 1.27,-1.27; A17 -1.27,-1.27; A18 -3.81,-1.27; A19 -6.35,-1.27; A20 -8.89,-1.27; A21 -11.43,-1.27; A22 -13.97,-1.27; A23 -16.51,-1.27; A24 -19.05,-1.27; A25 -21.59,-1.27; A26 -24.13,-1.27; A27 -26.67,-1.27; A28 -29.21,-1.27; A29 -31.75,-1.27; A30 -34.29,-1.27; A31 -36.83,-1.27; A32 -39.37,-1.27; B1 39.37,1.27; B2 36.83,1.27; B3 34.29,1.27; B4 31.75,1.27; B5 29.21,1.27; B6 26.67,1.27; B7 24.13,1.27; B8 21.59,1.27; B9 19.05,1.27; B10 16.51,1.27; B11 13.97,1.27; B12 11.43,1.27; B13 8.89,1.27; B14 6.35,1.27; B15 3.81,1.27; B16 1.27,1.27; B17 -1.27,1.27; B18 -3.81,1.27; B19 -6.35,1.27; B20 -8.89,1.27; B21 -11.43,1.27; B22 -13.97,1.27; B23 -16.51,1.27; B24 -19.05,1.27; B25 -21.59,1.27; B26 -24.13,1.27; B27 -26.67,1.27; B28 -29.21,1.27; B29 -31.75,1.27; B30 -34.29,1.27; B31 -36.83,1.27; B32 -39.37,1.27 | hole 2.794: 44.45,-3.81; -44.45,-3.81
HDF26H = drill 0.9 octagon: 1 8.639,2.54 | drill 0.9: 2 6.353,2.54; 3 4.067,2.54; 4 1.781,2.54; 5 -0.505,2.54; 6 -2.791,2.54; 7 -5.077,2.54; 8 -7.363,2.54; 9 -9.649,2.54; 10 9.782,0; 11 7.496,0; 12 5.21,0; 13 2.924,0; 14 0.638,0; 15 -1.648,0; 16 -3.934,0; 17 -6.22,0; 18 -8.506,0; 19 8.639,-2.54; 20 6.353,-2.54; 21 4.067,-2.54; 22 1.781,-2.54; 23 -0.505,-2.54; 24 -2.791,-2.54; 25 -5.077,-2.54; 26 -7.363,-2.54 | hole 3: -16.65,0; 16.65,0

### Placement (x,y rotation side)
C1  11.55,35.41 90 top
C2  50.2,93.78 180 top
C3  100.28,75.73 270 top
C4  98.09,71.18 0 top
C5  57.49,90.37 180 top
C6  72.53,90.38 180 top
C7  118.55,36.09 180 top
C8  134.16,89.98 0 top
C9  57.9,65.9 180 top
C10  71.5,64.6 0 top
C11  98.1,11.3 180 top
C12  83.82,76.2 90 top
C13  104.5,80.1 270 top
C14  146,58 180 top
C15  127,63.5 180 top
C16  106.93,63.75 180 top
C17  146.05,79.47 90 top
C18  48.4,13.2 270 top
C19  123.3,45.1 180 top
D1  119.38,63.5 0 top
D2  123.19,69.85 90 top
IC1  23.27,39.21 270 top
IC2  44.86,46.83 270 top
IC3  66.45,44.29 270 top
IC4  93.09,38.94 270 top
IC5  41.04,82.33 270 top
IC6  56.27,78.54 270 top
IC7  71.51,78.54 270 top
IC8  117.22,23.7 270 top
IC9  129.97,23.69 270 top
IC10  91.8,78.57 270 top
IC11  118.11,81.28 0 top
IC12  133.35,78.74 270 top
IN  164,60 270 top
JP1  75.9,10.1 270 top
LED1  98.34,88.1 180 top
OSC1  61.3,12 0 top
OUT  164,75 270 top
R1  35.36,19.62 270 top
R2  45,19 270 top
R3  38.41,19.6 270 top
R4  78.7,69.6 90 top
R5  78.69,88.71 90 top
R6  131.9,43.61 180 top
R7  99.06,81.28 90 top
R8  87.1,71 180 top
R9  94.31,86.9 270 top
R10  109.6,24.8 90 top
R11  32.7,78.5 90 top
R12  102.87,86.36 270 top
R13  140.97,78.74 90 top
R14  151.9,89.64 270 top
R15  109.58,81.3 90 top
R16  125.73,83.82 270 top
R17  145.97,69.35 90 top
R18  153.5,75 180 top
R19  154,61 180 top
R20  141.47,64.69 270 top
R21  125.26,53.35 270 top
R22  133.24,63.45 0 top
R23  133.09,54.63 270 top
R24  110.46,59.71 180 top
R25  125.73,77.47 270 top
R26  113.04,67.31 180 top
RN2  105.79,37.67 90 top
ROM  161.91,94.44 90 top
S1  166,87 90 top
SPK  143.51,48.26 270 top
T1  84.77,87.56 180 top
T2  137.16,59.69 90 top
T3  129.54,58.42 90 top
T4  118.11,72.39 180 top
X1  6.6,50 270 top
X2  161.5,31 90 top

### Tracks (layer width: path | path; a pad name or v marks a point on that pad's centre or on a via)
+5V
  Top 0.3: IC2.31 55.36,63.34 55.4,63.3 | IC2.30 55.3,60.8 55.4,60.9
  Top 0.5: 11.5,38 C1.2 | 47.64,93.76 C2.2 | 60.03,86.21 IC6.14 | 78.65,64.57 R4.1 | C7.1 121.03,36.03 | 55.4,65.9 C9.2 | 128.5,36.1 128.59,36.09 128.89,35.81 | 133.76,32.6 IC9.16 147.82,32.58 157.9,22.5 161.59,22.5 X2.18 | 126.82,36.17 126.9,36.09 | R1.2 | C10.2 74.04,64.43 74.07,64.4
  Top 0.8: 11.5,38 9.7,36.2 9.7,17.54 X1.B3 | IC5.20 47.64,93.76 | C2.2 47.66,92.74 48.6,91.8 58.6,91.8 C5.1 | C5.1 60.03,86.21 | IC7.14 75.32,90.13 C6.1 | IC3.28 74.07,64.4 74.07,64.57 78.65,64.57 78.65,65.95 82,69.3 82,70.98 R8.2 82.02,71.86 C12.1 83.86,73.66 84.96,74.76 IC10.4 89.76,74.76 91.9,76.9 91.9,80.3 93.9,82.3 95.53,82.3 IC10.8 | 64.4,67.2 56.66,67.2 C9.2 | 64.4,67.2 71.44,67.2 C10.2 | C7.1 119,38.2 114.3,38.2 109.6,33.5 R10.2 107.23,27.51 RN2.1 IC4.26 100.6,27.4 98.7,27.4 95.56,24.26 C11.2 84.6,11.3 73,22.9 55.7,22.9 | IC8.16 121.03,36.03 | 55.4,23.2 55.4,60.9 55.4,63.3 55.4,65.86 C9.2 | 55.4,23.2 55.4,23 | X1.B2 8.44,12.6 33.4,12.6 R1.2 38.4,14.55 38.41,14.54 R3.2 40.28,14.52 40.9,13.9 44.98,13.9 R2.2 46.58,13.92 C18.1 | C5.1 61.43,90.37 64.15,87.65 | 64.15,87.65 64.3,87.5 64.3,67.3 64.4,67.2 | IC2.32 55.34,65.88 C9.2 | C7.1 126.9,36.09 128.59,36.09 | 128.89,35.81 132.1,32.6 133.76,32.6 | 126.82,36.17 R6.2 125.81,43.61 C19.+ 124.32,47.33 R21.2 125.26,52.87 T3.3 | 109.4,93.79 R5.2 78.48,93.79 C6.1 | 109.4,93.79 116.6,93.79 | 116.6,93.79 134.21,93.79 136.6,91.4 136.6,90.08 C8.2 137.16,89.52 IC12.14 | 109.4,93.79 109.58,93.61 R15.2 109.56,86.4 | 116.6,93.79 116.84,93.55 IC11.7 116.84,82.76 118.3,81.3 125.73,81.3 | 125.73,81.3 R16.2 | R25.1 125.73,81.3 | R9.2 94.31,85.59 95.7,84.2 95.7,82.47 IC10.8 | IC10.8 98.89,82.38 R7.2 100.33,82.55 R12.2 | 55.7,22.9 55.4,23.2 | C18.1 53.61,15.74 OSC1.14 | 55.7,22.9 53.8,22.9 48.4,17.5 C18.1 | C6.1 74.02,90.38 72.1,92.3 68.8,92.3 64.15,87.65
  Bottom 0.2: R11.2 32.7,84.5 35.6,87.4 38.4,87.4 40.9,89.9 40.9,92.1 42.5,93.7 44.79,93.7 IC5.20
  Bottom 0.8: IC1.11 C1.2
  pour Bottom (isolate 0.2, rank 5): 4,17 9,17 9,12 4,12
+5VG
  Bottom 0.2: X1.A29 X1.B29
/BAO
  Bottom 0.2: X1.A5 5.49,20.79 6.7,19.5 11.3,19.5 12.2,18.6 17.4,18.6 18.9,20.1 30.75,20.1 IC1.23
/BUSRQ  (via drill 0.3)
  Top 0.2: v23,25.2 v23,39.2
  Bottom 0.2: X1.B12 9.27,38.57 9.9,39.2 v23,39.2 | v23,25.2 30.7,25.2 30.84,25.24 IC1.25 34.82,25.24 R1.1
/CSBWS
  Bottom 0.2: IC5.15 40.06,81.06 38.8,79.8 33.1,79.8 27.5,74.2 21.9,74.2 19,77.1 13.6,77.1 11,79.7 11,80.7 8.7,83 7.1,83 6.6,83.5 6.6,88.1 X1.B32
/CSRAM  (via drill 0.3)
  Top 0.2: IC5.19 46.28,91.22 46.9,90.6 v46.9,41.5
  Bottom 0.2: IC3.20 74.05,40.5 63.1,40.5 61.8,39.2 56.2,39.2 53.9,41.5 v46.9,41.5
/CSROM  (via drill 0.3)
  Top 0.2: v42.8,40.5 42.8,83.1 43.3,83.6 IC5.16
  Bottom 0.2: v42.8,40.5 52.46,40.5 IC2.22
/HALT
  Bottom 0.2: IC1.18 15.59,20.1 12.5,20.1 9.2,23.3 9.17,23.33 X1.B6
/INT  (via drill 0.3)
  Top 0.2: IC1.16 17.86,25.24 19.7,23.4 19.7,18.2 v21.4,16.5
  Bottom 0.2: IC4.23 96.81,19.89 93,23.7 65,23.7 62.9,21.6 52.3,21.6 49.8,24.1 44.9,24.1 | v21.4,16.5 33.2,16.5 36,19.3 39.1,19.3 43.9,24.1 44.9,24.1 | X1.B9 8.55,30.95 14.2,25.3 15.59,25.3 IC1.16 | R2.1 44.92,24.08 44.9,24.1
/IORQ  (via drill 0.3)
  Top 0.2: v11.5,24.1 11.5,18.4 14.8,15.1 15.63,15.1 IC1.20 | v83.1,28.8 v83.1,46.8
  Bottom 0.2: v83.1,28.8 80,25.7 65.6,25.7 62.5,22.6 52.7,22.6 49.6,25.7 44.1,25.7 38.7,20.3 35.6,20.3 33.9,18.6 20.8,18.6 17.3,15.1 15.67,15.1 IC1.20 | X1.B8 8.69,28.41 10,27.1 10,25.6 v11.5,24.1 | v83.1,46.8 89,46.8 95.1,52.9 IC4.36
/M1  (via drill 0.3)
  Top 0.2: v65.6,65.1 v65.6,27.4 | v33.6,21.5 33.6,29.2 32.5,30.3 30.91,30.3 IC1.27
  Bottom 0.2: X1.A6 6.6,22.1 9.6,22.1 12.6,19.1 17.2,19.1 18.7,20.6 28.6,20.6 29.5,21.5 v33.6,21.5 39.2,21.5 43.9,26.2 49.8,26.2 52.9,23.1 62.3,23.1 65.6,26.4 v65.6,27.4 | v65.6,65.1 65.6,85.4 66.4,86.2 67.66,86.2 IC7.1
/MEMDI
  Bottom 0.2: X1.B23 8.5,66.5 9.8,65.2 27,65.2 32.7,70.9 R11.1 | 32.71,73.4 R11.1 | R11.1 37.18,73.39 IC5.9
/MREQ  (via drill 0.3)
  Top 0.2: v13.1,66 13.1,18.8 14.3,17.6 15.63,17.6 IC1.19 | v23,66 v23,73.3
  Bottom 0.2: X1.A23 5.33,66.53 6.6,67.8 11.3,67.8 v13.1,66 v23,66 | v23,73.3 27.4,73.3 32.6,78.5 37.21,78.5 IC5.7
/NMI  (via drill 0.3)
  Top 0.2: v64.6,26.4 v64.6,63.9 | IC7.8 76.82,70.92 77.4,71.5 77.4,80.4 76.8,81 75.4,81 IC7.12
  Bottom 0.2: X1.A9 5.33,30.87 6.5,29.7 8.6,29.7 10.7,27.6 10.7,26.2 14.3,22.7 IC1.17 19.6,22.7 20,23.1 28.7,23.1 29.3,23.7 33.9,23.7 34.2,23.4 36.2,23.4 36.9,24.1 36.9,25.1 37.9,26.1 43,26.1 43.6,26.7 49.9,26.7 53.1,23.6 62,23.6 64.5,26.1 64.5,26.3 v64.6,26.4 | v64.6,63.9 66.3,63.9 73.3,70.9 75.3,70.9 IC7.8
/RD  (via drill 0.3)
  Top 0.2: v22.3,66.8 v22.3,44.8 22.3,21.4 28.6,15.1 30.87,15.1 IC1.21
  Bottom 0.2: 7.85,69.05 X1.B24 7.92,69 11.6,69 13.8,66.8 v22.3,66.8 | v22.3,44.8 28.4,44.8 28.7,44.5 39.6,44.5 40.66,45.56 IC2.24 54.74,45.56 56,44.3 68.8,44.3 70.1,45.6 74.03,45.6 IC3.22 83.26,45.56 84,46.3 89.5,46.3 93.5,50.3 100.64,50.3 IC4.35
/RESET  (via drill 0.3)
  Top 0.2: v26.6,71.7 v26.6,38.3 26.6,30.3 29.1,27.8 30.87,27.8 IC1.26 | v54.7,84.8 54.7,79.3 53.9,78.5 52.5,78.5 IC6.4
  Bottom 0.2: X1.A12 6.6,37.3 9.2,37.3 9.8,36.7 24.2,36.7 25.8,38.3 v26.6,38.3 | IC6.4 50.34,78.54 49.1,77.3 32.2,77.3 v26.6,71.7 | v54.7,84.8 61.3,84.8 64,87.5 69,87.5 70.3,86.2 | 70.3,86.2 70.3,84.5 69.4,83.6 67.72,83.6 IC7.2 | R9.1 93.75,87.57 T1.3 86.04,88.17 85.01,89.2 77.5,89.2 76.4,88.1 72.2,88.1 70.3,86.2
  Bottom 0.3: R9.1 97,88.17 LED1.K
/RFSH  (via drill 0.3)
  Top 0.2: v25.2,21.8 v25.2,31.7
  Bottom 0.2: X1.A7 5.43,25.87 6.7,24.6 8.8,24.6 12.3,21.2 19.7,21.2 20.3,21.8 v25.2,21.8 | IC1.28 30.76,32.86 30.7,32.8 28.1,32.8 27,31.7 v25.2,31.7
/WAIT
  Bottom 0.2: X1.A8 5.33,28.37 6.5,27.2 8.6,27.2 9.4,26.4 9.4,24.9 12.6,21.7 19.4,21.7 20.3,22.6 30.79,22.6 IC1.24 36.43,22.7 R3.1
/WR  (via drill 0.3)
  Top 0.2: v68.1,24.5 68.1,54.3 72,58.2 74.01,58.2 IC3.27
  Bottom 0.2: v68.1,24.5 67.8,24.2 64.8,24.2 62.7,22.1 52.5,22.1 49.4,25.2 44.3,25.2 38.9,19.8 35.8,19.8 33.62,17.62 IC1.22 30.87,17.6 30.2,17.6 30.1,17.7 21.1,17.7 19.5,16.1 17.8,14.3 11.6,8.1 4.3,8.1 2.2,10.2 2.2,66.9 4.35,69.05 X1.A24
AB0  (via drill 0.3)
  Top 0.2: v82.2,39.2 v82.2,50.4
  Bottom 0.2: IC1.30 IC2.12 39.74,37.94 41,39.2 53.9,39.2 55.1,38 58.77,38 IC3.10 61.64,37.94 62.9,39.2 v82.2,39.2 | X1.A13 5.39,41.11 6.7,39.8 9,39.8 10.7,41.5 25.5,41.5 29.1,37.9 30.85,37.9 IC1.30 | 30.83,38 IC1.30 | v82.2,50.4 85.44,50.4 IC4.6
AB1  (via drill 0.3)
  Top 0.2: v79.6,52.9 v79.6,41.7
  Bottom 0.2: X1.B13 9.19,41.11 10.1,42 25.7,42 27.2,40.5 30.87,40.5 IC1.31 IC2.11 39.48,40.48 41.3,42.3 50.2,42.3 50.5,42 54.4,42 55.9,40.5 58.81,40.5 IC3.9 61.78,40.48 63,41.7 v79.6,41.7 | v79.6,52.9 IC4.5
AB2
  Bottom 0.2: X1.A14 5.35,43.65 6.6,42.4 9.5,42.4 11.1,44 28.1,44 29.1,43 30.87,43 IC1.32 31.12,43.02 32.7,43 37.2,43 IC2.10 39.42,43.02 40.7,44.3 54.7,44.3 55.9,43.1 58.75,43.1 IC3.8
AB3
  Bottom 0.2: IC3.7 58.79,45.6 56,45.6 54.8,46.8 40.6,46.8 39.36,45.56 IC2.9 IC1.33 30.85,45.6 21.8,45.6 20.7,44.5 10.4,44.5 9.6,43.7 8,43.7 7.95,43.65 X1.B14
AB4
  Bottom 0.2: X1.A15 5.33,46.17 6.6,44.9 9.3,44.9 11,46.6 22.3,46.6 23.8,48.1 IC1.34 IC2.8 38.2,48.1 39.4,49.3 54.8,49.3 55.9,48.2 58.73,48.2 IC3.6
AB5
  Bottom 0.2: X1.B15 8.91,46.19 9.5,46.2 10.4,47.1 22.1,47.1 23.6,48.6 28.2,48.6 30.2,50.6 30.85,50.6 IC1.35 IC2.7 38.34,50.64 39.7,52 54.8,52 56.2,50.6 58.79,50.6 IC3.5
AB6  (via drill 0.3)
  Top 0.2: v63.6,59.3 63.6,55.2 61.6,53.2 58.85,53.2 IC3.4
  Bottom 0.2: X1.A16 5.37,48.73 6.6,47.5 9.7,47.5 11.3,49.1 22.7,49.1 26.8,53.2 30.71,53.2 IC1.36 31.38,53.18 33,53.2 37.1,53.2 IC2.6 38.78,53.18 39.8,54.2 54.9,54.2 56,53.1 58.75,53.1 IC3.4 58.85,53.2 | v63.6,59.3 63.6,81.3 61.3,83.6 60.1,83.6 IC6.13
AB7
  Bottom 0.2: X1.B16 7.93,48.73 7.96,48.7 9.7,48.7 10.6,49.6 20.6,49.6 26.6,55.6 30.77,55.6 IC1.37 IC2.5 38.92,55.72 39.9,56.7 56.2,56.7 57.3,55.7 58.81,55.7 IC3.3 58.91,55.8 60,55.8 62,57.8 62,80.7 61.6,81.1 60.1,81.1 IC6.12
AB8  (via drill 0.3)
  Top 0.2: v32.9,51.9 32.9,57.6 32.3,58.2 30.95,58.2 IC1.38
  Bottom 0.2: X1.A18 5.33,53.77 6.5,52.6 11.1,52.6 12,51.7 19.1,51.7 25.6,58.2 30.83,58.2 IC1.38 | IC3.25 73.95,53.3 69.9,53.3 68.5,51.9 56.1,51.9 54.8,53.2 53.5,53.2 53.48,53.18 IC2.27 52.46,53.2 39.8,53.2 38.5,51.9 v32.9,51.9
AB9  (via drill 0.3)
  Top 0.2: v33.9,49.4 33.9,59.4 32.5,60.8 IC1.39
  Bottom 0.2: IC3.24 74.03,50.6 69.6,50.6 68.3,49.3 56.1,49.3 54.76,50.64 IC2.26 52.42,50.7 39.9,50.7 38.6,49.4 v33.9,49.4 | IC1.39 27.5,60.8 18.9,52.2 12.5,52.2 10.89,53.81 10.88,53.8 9.2,53.8 9.19,53.81 X1.B18
AB10  (via drill 0.3)
  Top 0.2: v35,41.7 35,60.6 32.3,63.3 30.93,63.3 IC1.40 30.89,67.99 v30.9,68.1 35,72.2 35,93.3 35.46,93.76 IC5.1
  Bottom 0.2: 5.35,56.35 X1.A19 4.45,56.35 3.3,57.5 3.3,64.4 4.1,65.2 9.1,65.2 9.6,64.7 27.5,64.7 v30.9,68.1 | IC3.21 73.99,43.1 62.9,43.1 61.6,41.8 55.9,41.8 54.68,43.02 IC2.23 52.4,43.1 40.9,43.1 39.5,41.7 v35,41.7
AB11  (via drill 0.3)
  Top 0.2: v39.9,48.1 v39.9,69.7 39.9,90.4 39.08,91.22 IC5.2 | v9.7,56.9 v9.7,61.4
  Bottom 0.2: IC3.23 69.8,48.1 68.5,46.8 56.1,46.8 54.8,48.1 IC2.25 v39.9,48.1 | v9.7,61.4 10.2,61.9 12.7,61.9 14.1,63.3 15.49,63.3 IC1.1 15.76,63.34 16.1,63.3 27.1,63.3 33.4,69.6 39.8,69.6 v39.9,69.7 | X1.B19 8.25,56.35 8.4,56.3 9.1,56.3 v9.7,56.9
AB12  (via drill 0.3)
  Top 0.2: v25.8,57.4 v25.8,62.4 v25.8,77.3
  Bottom 0.2: IC3.2 58.77,58.2 57.2,58.2 56.2,57.2 40,57.2 38.94,58.26 IC2.4 37.18,58.2 34.9,58.2 33.8,57.1 26.1,57.1 v25.8,57.4 | v25.8,62.4 24.2,60.8 IC1.2 14.9,60.8 14.2,60.1 7.1,60.1 6.1,59.1 5.54,59.1 X1.A20 | IC5.3 35.08,88.68 25.8,79.4 v25.8,77.3
AB13  (via drill 0.3)
  Top 0.2: v41.7,55.8 v41.7,69 v41.7,86.1
  Bottom 0.2: X1.B20 7.9,58.9 11.5,58.9 12.1,58.3 15.61,58.3 IC1.3 16.3,58.3 22.8,58.3 33.5,69 v41.7,69 | v41.7,55.8 52.4,55.8 IC2.28 56.08,55.72 57.1,54.7 60.3,54.7 61.32,55.72 IC3.26 | IC5.4 37.46,86.14 37.5,86.1 v41.7,86.1
AB14  (via drill 0.3)
  Top 0.2: v11.1,57.3 v11.1,62.7 | v40.6,83.6 v40.6,60.8
  Bottom 0.2: X1.A21 5.43,61.43 6.7,62.7 v11.1,62.7 | v11.1,57.3 12.7,55.7 15.1,55.7 15.08,55.72 IC1.4 20.92,55.72 27.5,62.3 39.1,62.3 v40.6,60.8 43.1,58.3 52.4,58.3 52.44,58.26 IC2.29 54.66,58.26 57.2,60.8 IC3.1 | IC5.5 v40.6,83.6
AB15
  Top 0.2: IC2.3 38.2,60.8 39.2,61.8 39.2,80.6 38.74,81.06 IC5.6
  Bottom 0.2: IC2.3 34.7,60.8 33.7,61.8 27.8,61.8 19.18,53.18 IC1.5 15.6,53.23 15.5,53.23 14.2,53.3 12.5,53.3 10.7,55.1 7.1,55.1 6.6,55.6 6.6,57.1 6.1,57.6 4.3,57.6 3.8,58.1 3.8,59.6 4.4,60.2 6.1,60.2 7.2,61.3 7.74,61.3 X1.B21
BRAM  (via drill 0.3)
  Top 0.2: v57.9,88.7 57.9,76.8 58.7,76 IC6.10
  Bottom 0.2: v57.9,88.7 44.87,88.7 IC5.18
CLK  (via drill 0.3)
  Top 0.2: v88.9,52.9 v88.9,32.9 | JP1.2 81.9,10.1 82.8,9.2 95.8,9.2 97.8,11.2 97.8,23.37 99.4,24.97 IC4.25 | v28.5,56.3 v28.5,54.7
  Bottom 0.2: IC4.25 96.83,24.97 v88.9,32.9 | v88.9,52.9 87.6,54.2 56.3,54.2 55.8,54.7 39.1,54.7 38.8,54.4 28.8,54.4 v28.5,54.7 | IC1.6 19.74,50.64 25.4,56.3 v28.5,56.3
CLK_BUS
  Top 0.2: X1.A11 4.13,36.03 2.7,34.6 2.7,10.7 10.3,3.1 69.6,3.1 74,7.5 75.84,7.5 JP1.3
DB0  (via drill 0.3)
  Top 0.2: v79.5,22.3 v79.5,36.7 | v17.6,70.1 17.6,31.2 16.7,30.3 IC1.14
  Bottom 0.2: v17.6,70.1 16.1,71.6 8.8,71.6 8.79,71.59 X1.B25 | v79.5,36.7 62.7,36.7 61.4,35.4 IC3.11 55.2,35.4 54,36.6 41.2,36.6 40,35.4 IC2.13 34.6,35.4 33.6,36.4 28.8,36.4 28.5,36.1 25.6,36.1 23.6,34.1 21.1,34.1 17.3,30.3 15.67,30.3 IC1.14 | v79.5,22.3 79.5,22 84,17.5 85.32,17.5 IC4.19
DB1  (via drill 0.3)
  Top 0.2: v77.4,22.3 v77.4,34.1 | v18.6,70.1 18.6,29.2 17.18,27.78 IC1.15
  Bottom 0.2: IC1.15 15.67,27.8 17.2,27.8 22,32.6 26.9,32.6 28.2,33.9 33.2,33.9 34.2,32.9 37.12,32.9 37.16,32.86 IC2.14 40.16,32.86 41.4,34.1 53.9,34.1 55.3,32.7 58.67,32.7 IC3.12 61.46,32.86 62.7,34.1 v77.4,34.1 | X1.A25 5.33,71.63 6.6,72.9 9,72.9 9.6,72.3 16.5,72.3 18.6,70.2 v18.6,70.1 | v77.4,22.3 84.9,14.8 IC4.20
DB2  (via drill 0.3)
  Top 0.2: v76.6,31.6 v76.6,61.5 | v19.6,70.1 v19.6,35.4 v19.6,28.4
  Bottom 0.2: v19.6,70.1 19.6,70.2 16.8,73 10.3,73 9.2,74.1 7.9,74.1 X1.B26 | IC1.12 v19.6,35.4 | v76.6,31.6 62.8,31.6 61.52,30.32 IC3.13 58.81,30.3 55.1,30.3 53.8,31.6 41.9,31.6 40.62,30.32 IC2.15 35.58,30.32 34.56,31.3 28.7,31.3 27.2,29.8 21.8,29.8 20.4,28.4 v19.6,28.4 | v76.6,61.5 78.2,63.1 85.44,63.1 IC4.1
DB3  (via drill 0.3)
  Top 0.2: v81.5,29 v81.5,61.8 | v20.6,70.1 v20.6,45.5 v20.6,27.1
  Bottom 0.2: IC1.8 15.7,45.5 v20.6,45.5 | X1.A26 5.43,74.13 6.7,75.4 9.4,75.4 11.1,73.7 17.1,73.7 20.6,70.2 v20.6,70.1 | v81.5,29 80.3,27.8 74.3,27.8 74.28,27.78 IC3.15 74.05,27.8 73,27.8 72,28.8 55.1,28.8 54.08,27.78 IC2.17 52.02,27.78 52,27.8 50.9,27.8 49.9,28.8 23.6,28.8 21.9,27.1 v20.6,27.1 | v81.5,61.8 97.1,61.8 98.3,63 100.64,63 IC4.40
DB4  (via drill 0.3)
  Top 0.2: v80.5,30.3 v80.5,59.2 | v21.6,28.3 v21.6,48.1 v21.6,70.1
  Bottom 0.2: IC1.7 v21.6,48.1 | v21.6,70.1 21.6,70.3 17.5,74.4 11.6,74.4 9.3,76.7 7.9,76.7 X1.B27 | v80.5,30.3 74.6,30.3 74.22,30.32 IC3.16 73.99,30.4 62.8,30.4 61.7,29.3 55,29.3 53.98,30.32 IC2.18 41.92,30.32 40.9,29.3 23.3,29.3 22.3,28.3 v21.6,28.3 | v80.5,59.2 97,59.2 98.3,60.5 100.68,60.5 IC4.39
DB5  (via drill 0.3)
  Top 0.2: v78.8,32.9 v78.8,57 | v23.8,69.2 v23.8,43 v23.8,30.9
  Bottom 0.2: v23.8,30.9 27.3,30.9 28.2,31.8 40.7,31.8 41.76,32.86 IC2.19 53.74,32.86 55,31.6 61.5,31.6 62.8,32.9 74.03,32.9 IC3.17 74.56,32.86 74.6,32.9 v78.8,32.9 | IC1.9 16.12,43.02 16.2,43 v23.8,43 | X1.A27 5.37,76.67 6.6,77.9 9.5,77.9 12.3,75.1 17.9,75.1 v23.8,69.2 | v78.8,57 97.4,57 98.4,58 IC4.38
DB6  (via drill 0.3)
  Top 0.2: v77.4,35.4 v77.4,58.1 | v24.9,33.4 v24.9,40.5 v24.9,69.2
  Bottom 0.2: IC1.10 17.92,40.48 20.4,40.5 v24.9,40.5 | v24.9,69.2 18.3,75.8 12.7,75.8 9.3,79.2 X1.B28 | v24.9,33.4 26.7,33.4 27.7,34.4 33.6,34.4 33.9,34.1 40.1,34.1 41.4,35.4 IC2.20 53.9,35.4 55.2,34.1 61.4,34.1 62.7,35.4 IC3.18 v77.4,35.4 | IC4.3 85.4,58.1 v77.4,58.1
DB7  (via drill 0.3)
  Top 0.2: v78.1,38 v78.1,60.4 | v27.6,36.9 v27.6,70.5
  Bottom 0.2: X1.A28 5.41,79.21 6.7,80.5 9.1,80.5 13.1,76.5 18.6,76.5 24.6,70.5 v27.6,70.5 | IC1.13 15.84,32.86 16.5,32.8 18.9,32.8 20.8,34.7 23.5,34.7 25.7,36.9 v27.6,36.9 40.2,36.9 41.24,37.94 IC2.21 53.86,37.94 55.2,36.6 61.4,36.6 62.7,37.9 74.03,37.9 IC3.19 74.2,38 v78.1,38 | IC4.2 84.97,60.53 84.9,60.4 v78.1,60.4
GND  (via drill 0.5)
  other vias: 108,56 138.5,55.8 83,66 45,63 33,7 91,16 96,40 86,3 149,9 133,35 143,41 122.5,61 137.5,64.5 133.5,85 15,69 71,96 89.8,90.1 33,66 49,82 72.2,82.9 145,90 18.7,26.6 108,52.8 66.8,50.5 62.7,50.6 62.7,45.5 66.8,45.5 71,51.9 70.9,46.9 30.2,73.3 30.2,70.7 109.2,70.2 113,90.2 90.9,52.9 89.1,26 70.3,27.2 24.1,14.6 11.4,14.7 11.4,10.8 23.7,7 40.8,18.1
  pour Bottom (isolate 0.2, rank 6): 0,100 173,100 173,0 0,0
  pour Top (isolate 0.2): 0,100 173,100 173,0 0,0
N$1  (via drill 0.3)
  Top 0.2: IC6.9 58.14,73.46 56.4,75.2 v56.4,87.4
  Bottom 0.2: IC6.6 IC6.9 | v56.4,87.4 58.2,87.4 58.9,88.1 60.5,88.1 64.3,91.9 160.64,91.9 ROM.A
N$2
  Bottom 0.3: R15.1 111.78,76.22 113.03,77.47 IC11.1
N$3
  Bottom 0.3: IC12.3 IC12.12
N$4
  Bottom 0.3: IC12.1 IC12.2 128.27,83.82 127,85.09 R16.1 IC11.5
N$5
  Bottom 0.3: R14.1 158.22,94.72 159.21,95.71 ROM.K
N$6
  Bottom 0.3: IC12.13 R13.2 144.28,83.82 146.05,82.05 C17.2
N$7
  Bottom 0.3: R13.1 IC12.9 IC12.10 IC12.11
N$8
  Bottom 0.3: OUT.1 R18.1
N$9
  Bottom 0.3: LED1.A 102.4,88.1 R12.1
N$10
  Bottom 0.2: IC8.15 123.25,30.05 124.3,29 140.7,29 151.3,39.6 159.02,39.6 X2.1
N$11
  Bottom 0.2: IC7.10 IC7.11
N$12
  Bottom 0.2: IC7.9 77.48,73.46 R4.2
N$13
  Bottom 0.2: R5.1
  Bottom 0.5: IC7.13 R5.1
N$14  (via drill 0.3)
  Top 0.2: v116.1,18.6 116.1,31.3 114.8,32.6 IC8.1
  Bottom 0.2: IC8.1 114.31,32.59 114.32,32.6 118.2,32.6 119.2,33.6 123.1,33.6 124.1,32.6 126.14,32.6 IC9.1 | IC4.14 85.62,29.9 88.4,29.9 97.3,21 104.5,21 107.1,18.4 115.9,18.4 v116.1,18.6
N$15  (via drill 0.3)
  Top 0.2: v115.4,21.1 115.4,29.45 114.8,30.05 IC8.2
  Bottom 0.2: IC8.2 116.75,30.05 117.6,31 123.3,31 124.3,30 126.12,30 IC9.2 | IC4.13 85.56,32.5 87.7,32.5 96.7,23.5 104.7,23.5 107.1,21.1 v115.4,21.1
N$16
  Bottom 0.2: IC4.12 85.6,35 93.2,35 99.4,28.8 110.6,28.8 111.89,27.51 IC8.3 118.39,27.51 119.4,28.5 123.2,28.5 124.2,27.5 IC9.3
N$17
  Bottom 0.2: IC7.5 IC7.4 IC7.3
N$18
  Bottom 0.2: IC8.14 123.09,27.51 124.4,26.2 139.7,26.2 150.9,37.4 159.01,37.4 X2.2
N$19  (via drill 0.3)
  Top 0.2: v62.8,78.5 60.12,78.5 IC6.11
  Bottom 0.2: IC4.4 85.42,55.4 77.5,55.4 75.9,57 64.4,57 62.8,58.6 v62.8,78.5
N$20  (via drill 0.3)
  Top 0.2: v89.8,70.7 89.8,56 v90.4,55.4
  Bottom 0.2: IC7.6 70.24,73.46 71.3,72.4 88.1,72.4 v89.8,70.7 | v90.4,55.4 100.66,55.4 IC4.37
N$21
  Bottom 0.2: IC8.13 123.23,24.97 124.2,24 139.3,24 150.4,35.1 159.03,35.1 X2.3
N$22
  Bottom 0.2: IC8.12 123.17,22.43 124.3,21.3 138.4,21.3 149.9,32.8 159.04,32.8 X2.4
N$23
  Bottom 0.2: IC8.11 123.21,19.89 124.2,18.9 137.8,18.9 149.4,30.5 159.06,30.5 X2.5
N$24
  Bottom 0.2: IC8.10 123.15,17.35 124.2,18.4 130.3,18.4 132.3,16.4 137.1,16.4 148.9,28.2 159.05,28.2 X2.6
N$25
  Bottom 0.2: IC8.9 122.79,14.81 124.3,13.3 135.7,13.3 148.3,25.9 159.04,25.9 X2.7
N$26
  Bottom 0.2: IC8.7 114.45,17.35 119.8,12 136,12 147.7,23.7 158.9,23.7 X2.8
N$27  (via drill 0.3)
  Top 0.2: X2.26 160.86,23.64 159.7,24.8 156.9,24.8 148,33.7 v136.4,33.7
  Bottom 0.2: IC4.27 RN2.2 105.84,30 106.5,30 114.3,37.8 132.3,37.8 v136.4,33.7
N$28  (via drill 0.3)
  Top 0.2: X2.25 160.88,25.92 159.7,27.1 155.5,27.1 148.1,34.5 v137.2,34.5
  Bottom 0.2: IC4.28 RN2.3 108.29,32.59 114,38.3 133.4,38.3 v137.2,34.5
N$29  (via drill 0.3)
  Top 0.2: X2.24 160.89,28.21 159.7,29.4 154.2,29.4 148.4,35.2 v137.9,35.2
  Bottom 0.2: IC4.29 RN2.4 110.03,35.13 113.8,38.9 134.2,38.9 v137.9,35.2
N$30  (via drill 0.3)
  Top 0.2: X2.23 160.91,30.5 159.8,31.6 153.1,31.6 148.8,35.9 v138.7,35.9
  Bottom 0.2: IC4.30 RN2.5 111.67,37.67 113.4,39.4 135.2,39.4 v138.7,35.9
N$31  (via drill 0.3)
  Top 0.2: X2.22 160.82,32.78 159.7,33.9 151.8,33.9 149.2,36.5 v139.4,36.5
  Bottom 0.2: IC4.31 RN2.6 113.69,40.21 114,39.9 136,39.9 v139.4,36.5
N$32  (via drill 0.3)
  Top 0.2: X2.21 160.83,35.07 159.7,36.2 150.5,36.2 149.5,37.2 v140.1,37.2
  Bottom 0.2: IC4.32 RN2.7 112.05,42.75 114.4,40.4 136.9,40.4 v140.1,37.2
N$33  (via drill 0.3)
  Top 0.2: X2.20 160.85,37.35 159.7,38.5 156.6,38.5 156,37.9 v140.9,37.9
  Bottom 0.2: IC4.33 RN2.8 110.31,45.29 114.7,40.9 137.9,40.9 v140.9,37.9
N$34  (via drill 0.3)
  Top 0.2: X2.19 160.86,39.64 159.7,40.8 157.8,40.8 155.6,38.6 v141.6,38.6
  Bottom 0.2: IC4.34 RN2.9 108.57,47.83 115,41.4 138.8,41.4 v141.6,38.6
N$35
  Bottom 0.2: IC4.9 87.75,42.75 93.8,48.8 103.4,48.8 106.2,51.6 143.42,51.6 SPK.-
N$36
  Bottom 0.3: IC10.3 86.2,77.3 85.4,78.1 85.4,82.7 84.77,83.33 T1.2
N$37
  Bottom 0.3: IC10.6 IC10.7 98.89,79.84 R7.1 100.28,78.79 C3.+
N$38
  Bottom 0.3: C4.1 95.55,74.7 IC10.5
N$39
  Bottom 0.3: R6.1 142.11,43.61 SPK.+
N$40
  Bottom 0.2: IC4.24 104.47,22.43 107.2,19.7 109.58,19.7 R10.1 109.77,19.89 IC8.6
N$41
  Bottom 0.3: IC12.4 IC12.5 R25.2 123.19,76.2 T4.3
N$42
  Bottom 0.3: C14.1 148.54,59.54 149,60 149,60.92 R19.2
N$43
  Bottom 0.3: IC12.8 140.62,71.12 143.9,74.4 145.94,74.4 R17.2 | R17.2 145.97,76.85 C17.1 | R18.2 147.9,75 147.3,74.4 146,74.4 R17.2
N$44
  Bottom 0.3: T2.3 T3.2 R21.1
N$45
  Bottom 0.3: C14.2 141.85,59.61 R20.2 141.39,59.69 T2.2 135.25,61.45 134.5,62.2 R22.2
N$46
  Bottom 0.3: IN.1 160.08,60 R19.1
N$48
  Bottom 0.3: JP1.1 72.09,12.64 OSC1.8
N$50
  Bottom 0.3: R26.1 T4.2
N$51
  Bottom 0.3: R24.1 D1.C 108.2,63.5 C16.+ 107.95,67.3 R26.2
N$52
  Bottom 0.3: D2.C D1.A C15.-
N$53
  Bottom 0.3: R22.1 131.97,59.73 | 131.97,59.73 132,59.7 R23.1 | 131.97,59.73 131.93,59.69 T3.1 128.02,61.21 C15.+
N$276  (via drill 0.3)
  Top 0.2: v89.8,33.8 v89.8,40.2
  Bottom 0.2: v89.8,33.8 97.5,26.1 104.5,26.1 108.17,22.43 IC8.5 113.77,22.43 113.8,22.4 117.6,22.4 118.9,21.1 123,21.1 124.1,20 126.04,20 IC9.6 | v89.8,40.2 IC4.10
N$283
  Bottom 0.2: IC9.15 140.84,30.04 151.6,40.8 161.58,40.8 X2.10
N$284
  Bottom 0.2: IC9.14 140.1,27.5 151.1,38.5 161.6,38.5 X2.11
N$285
  Bottom 0.2: IC9.13 139.36,24.96 150.6,36.2 161.59,36.2 X2.12
N$286
  Bottom 0.2: IC9.12 138.62,22.42 150.2,34 161.52,34 X2.13
N$287
  Bottom 0.2: IC9.11 137.88,19.88 149.6,31.6 161.56,31.6 X2.14
N$288
  Bottom 0.2: IC9.10 137.14,17.34 149.2,29.4 161.55,29.4 X2.15
N$301
  Bottom 0.2: IC9.9 136.4,14.8 148.7,27.1 161.57,27.1 X2.16
N$302
  Bottom 0.2: X2.17 161.48,24.8 148,24.8 135.9,12.7 120.1,12.7 118.7,14.1 118.7,15.3 119.4,16 123.1,16 124.4,17.3 126.12,17.3 IC9.7
RAMDI
  Top 0.2: IC6.5 54,76 59.1,70.9 60.06,70.9 IC6.8
  Bottom 0.2: IC5.8 39.02,75.98 40.4,74.6 48.9,74.6 50.2,75.9 52.36,75.9 IC6.5
RESET_BUTTON
  Bottom 0.2: 106.7,81.2 114.1,88.6 154.4,88.6 155.5,87.5 158.87,87.5 165.5,87.5 167.2,89.2 S1.2
  Bottom 0.3: IC10.2 92.24,79.84 | 92.24,79.84 93.5,81.1 105,81.1 | 105,81.1 106.6,81.1 106.7,81.2 | R8.1 92.18,79.78 92.24,79.84 | C13.+ 104.98,81.12 105,81.1
RX  (via drill 0.3)
  Top 0.3: v120.3,66.7 120.3,54 v120.2,53.9
  Bottom 0.2: IC4.7 89.03,47.83 95.1,53.9 v120.2,53.9
  Bottom 0.3: IC12.6 127.26,73.66 v120.3,66.7
TX  (via drill 0.3)
  Top 0.2: v88.4,68.4 87.6,67.6 87.6,28.1 87,27.5 IC4.15
  Bottom 0.2: IC11.2 116.8,77.43 116.8,75.8 115.4,74.4 109,74.4 103.7,69.1 89.1,69.1 v88.4,68.4

### Text on the board
tPlace: K | JLCJLCJLCJLC | KRAMER MC CPU-BOARD | v1.0 | K | RST | LS00 | LS00 | GAL16V8 | LS00 | TAPE | LS138 | LS138 | ROM | RAM | KEYBOARD | OSC1 | BWS | CLK Source | redesign 2022 by [ferryTALE]
tNames: MB111